# EasyEDA Pro project TeensySensorBoardV2.eprj, schematic Teensy Sensor Board V2

## Sheets
1 Teensy: Board Name: Board; Create Date: 2025-07-06; Page Name: Teensy; Project Name: TeensySensorBoardV2; Schematic Name: Teensy Sensor Board V2; Update Date: 2025-07-08; Company: Wimble Robotics; Drawed: Michael Wimble; Page Size: A4; Part Number: JLCPCB-002; Reviewed: Michael Wimble; Version: V1.0
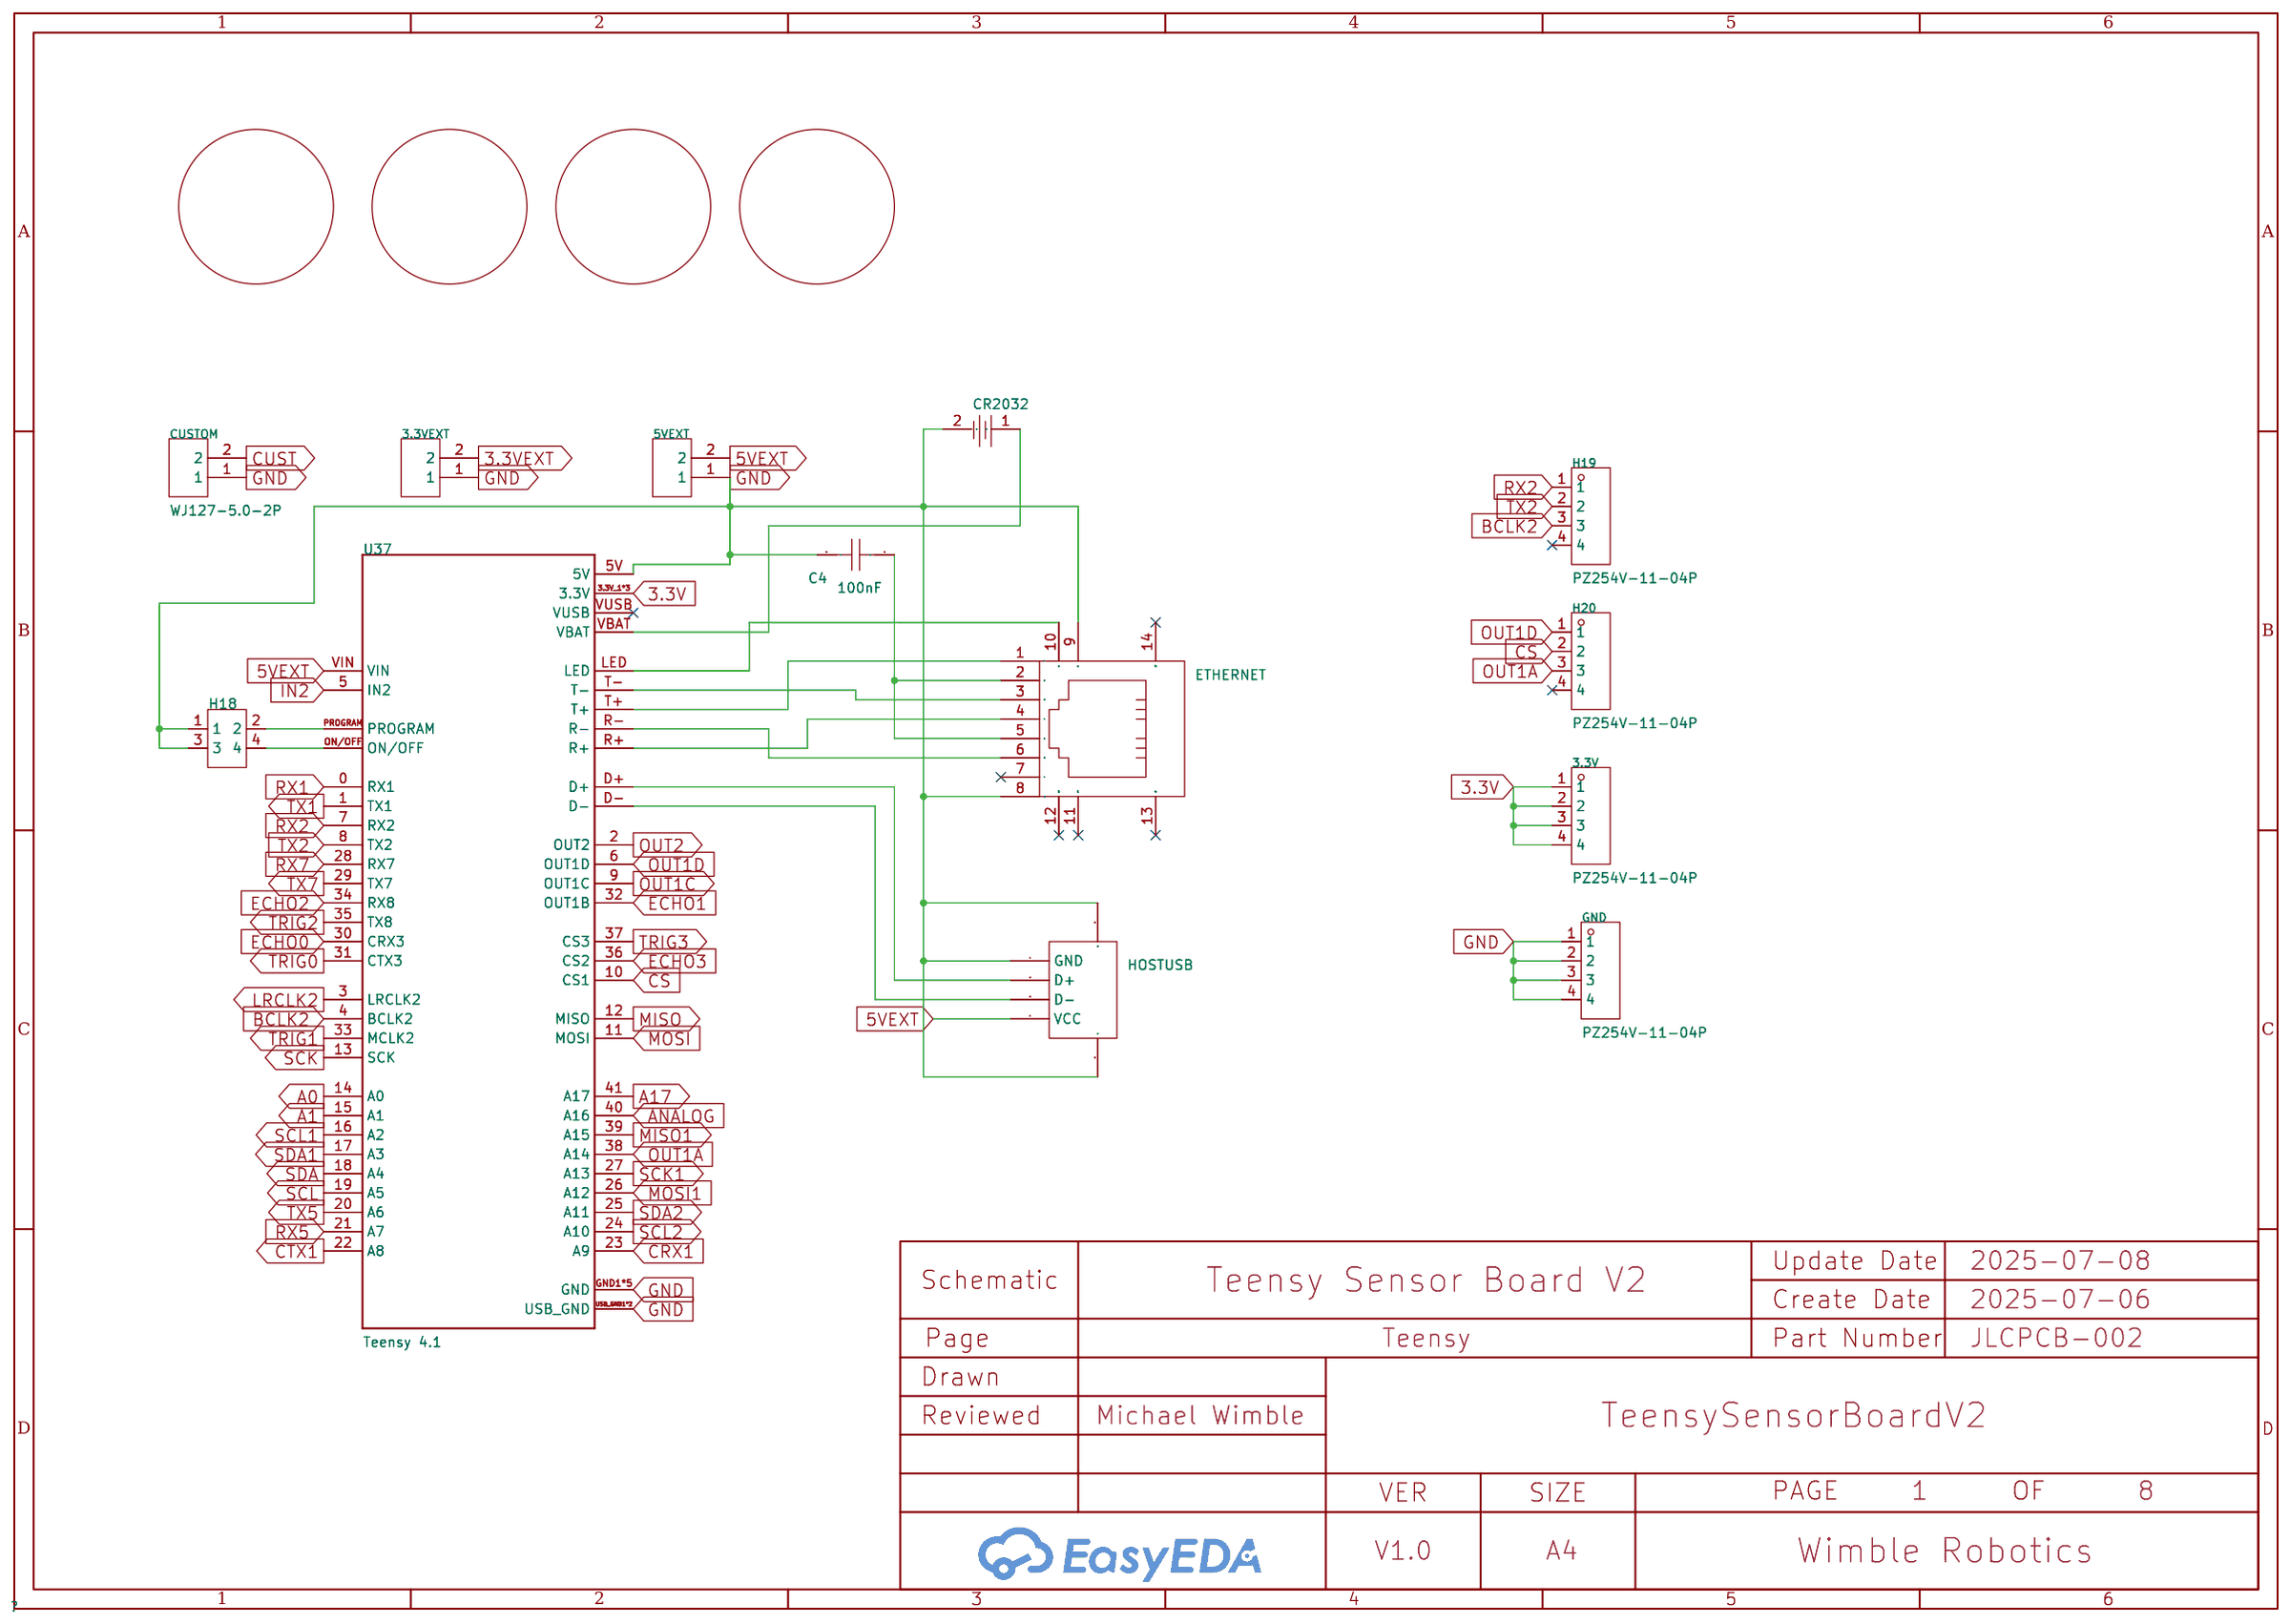
[diagram p0: Teensy]
2 I2C Multiplexer 1: Page Name: I2C Multiplexer 1; Update Date: 2025-07-07
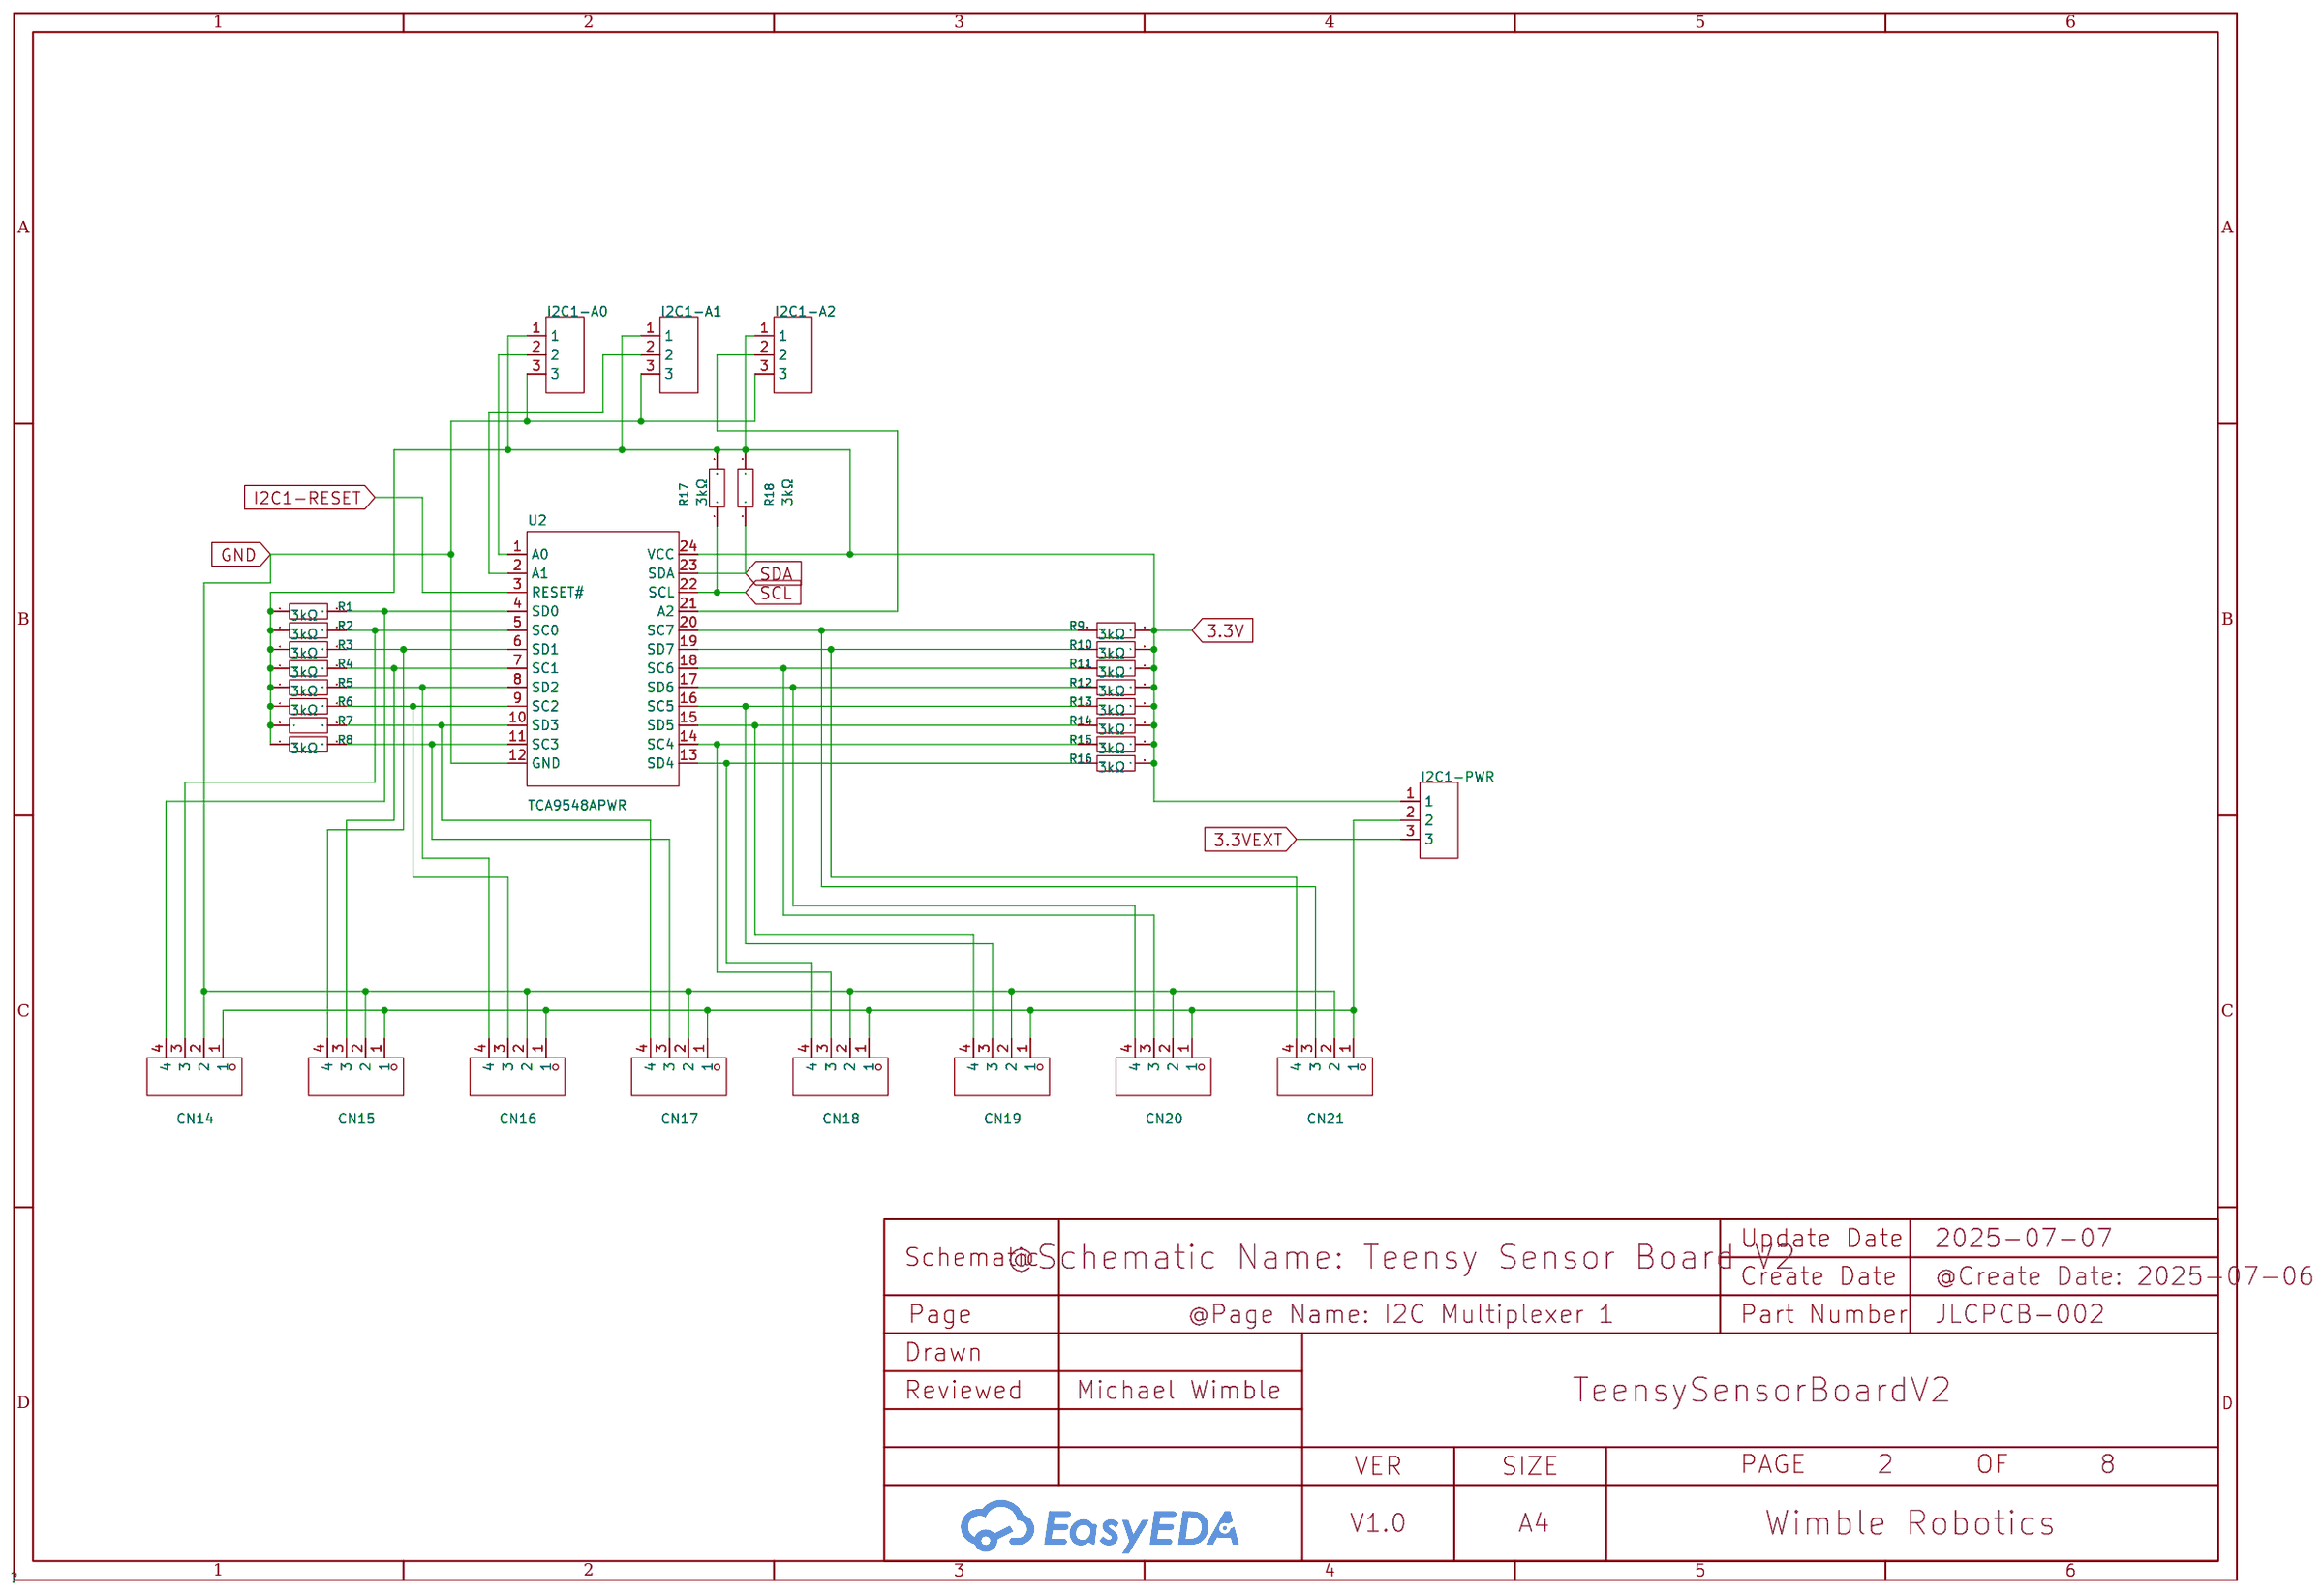
[diagram p1: I2C Multiplexer 1]
3 Misc: Page Name: Misc; Update Date: 2025-07-07
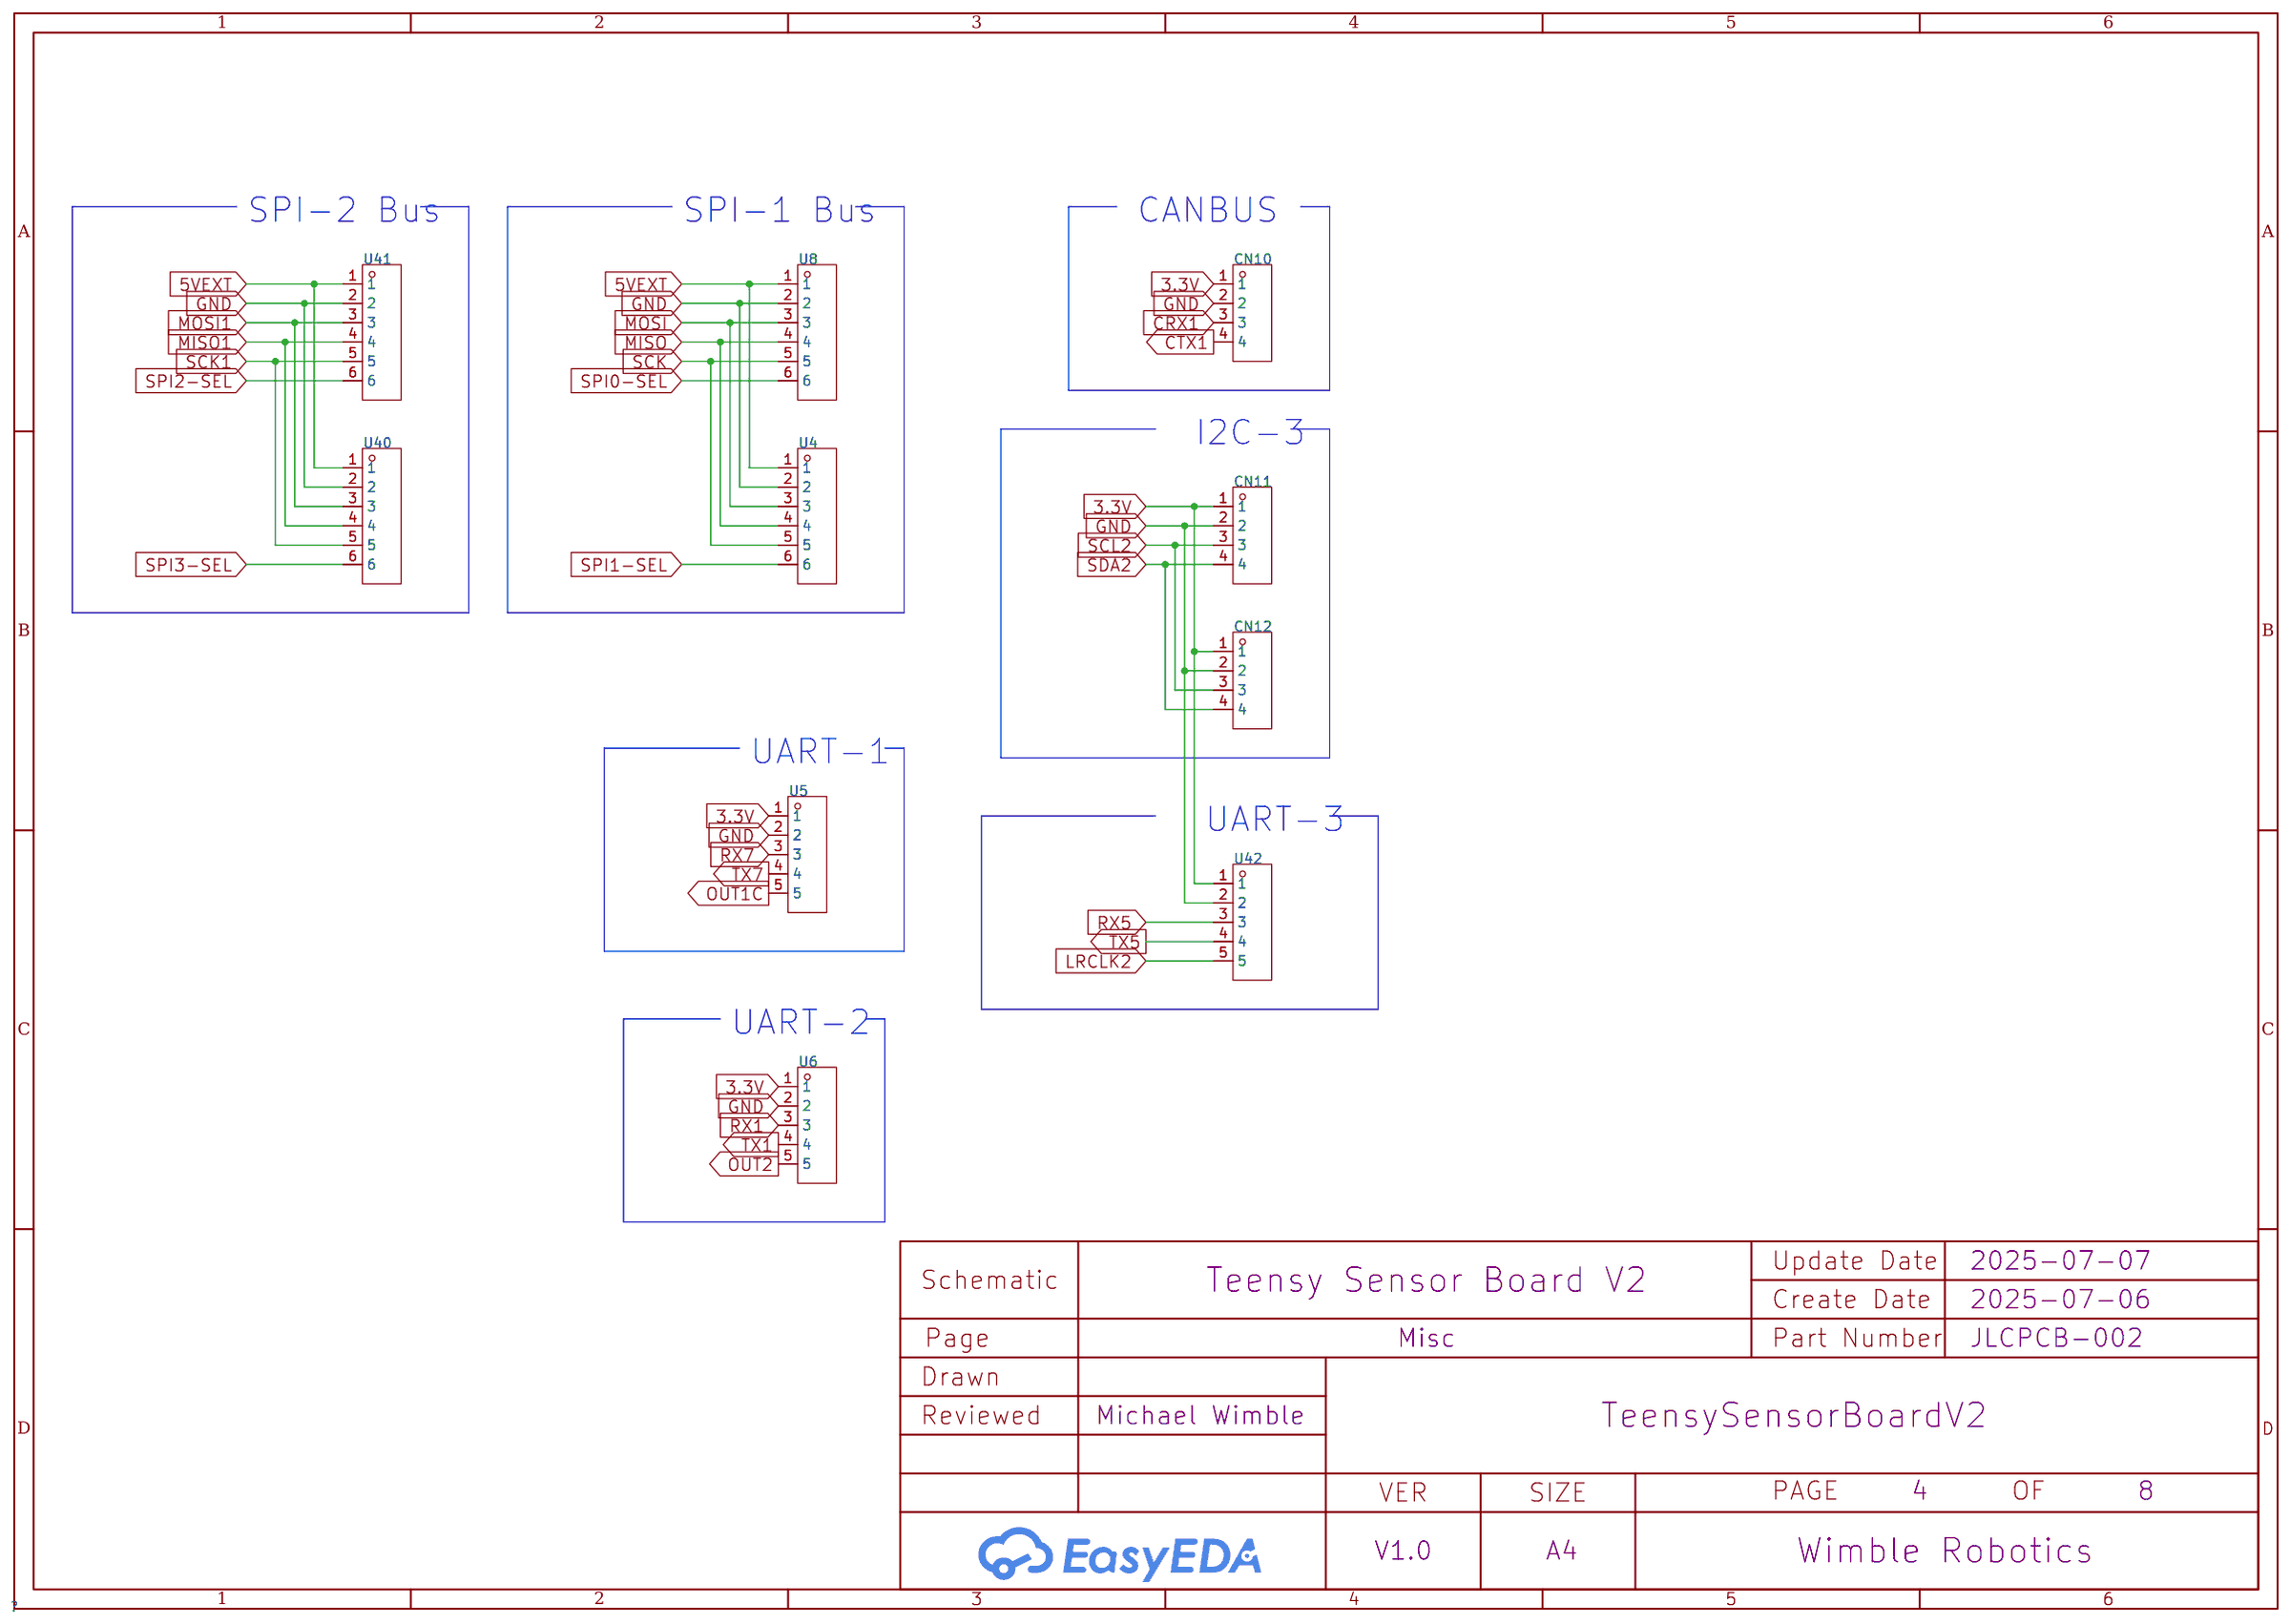
[diagram p2: Misc]
4 SONAR: Page Name: SONAR; Update Date: 2025-07-06
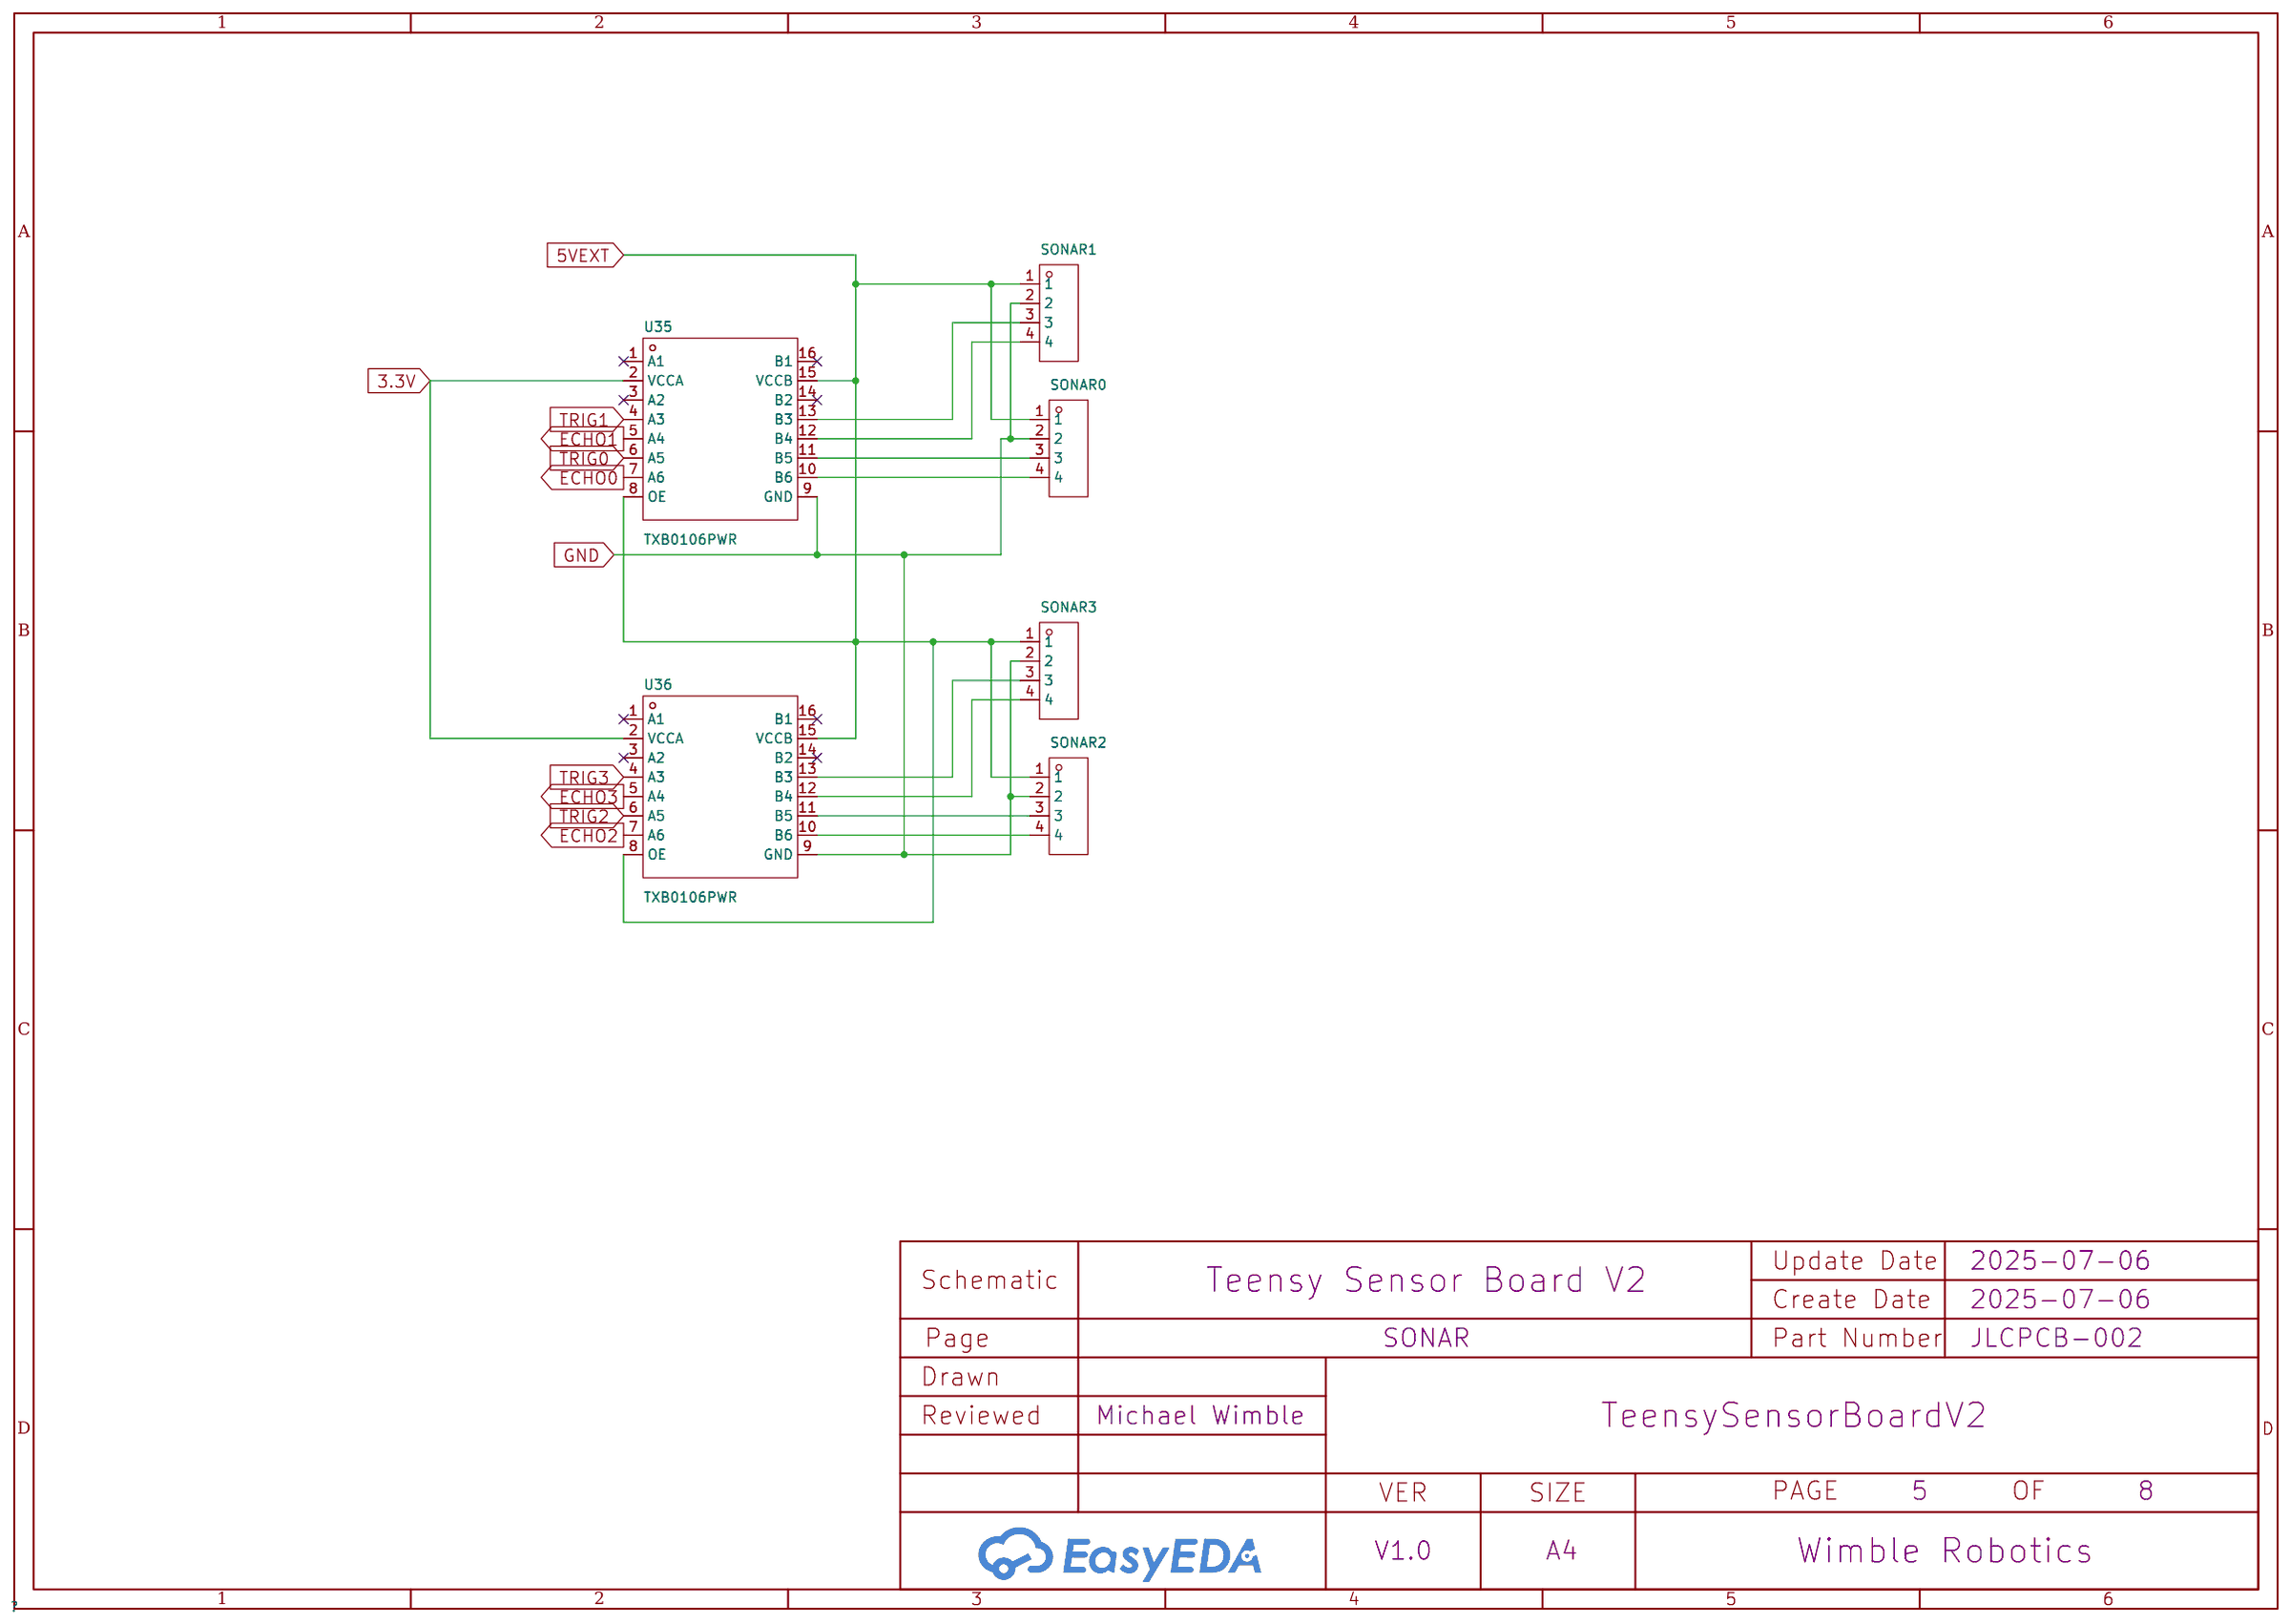
[diagram p3: SONAR]
5 I2C Multiplexer 2: Page Name: I2C Multiplexer 2; Update Date: 2025-07-07
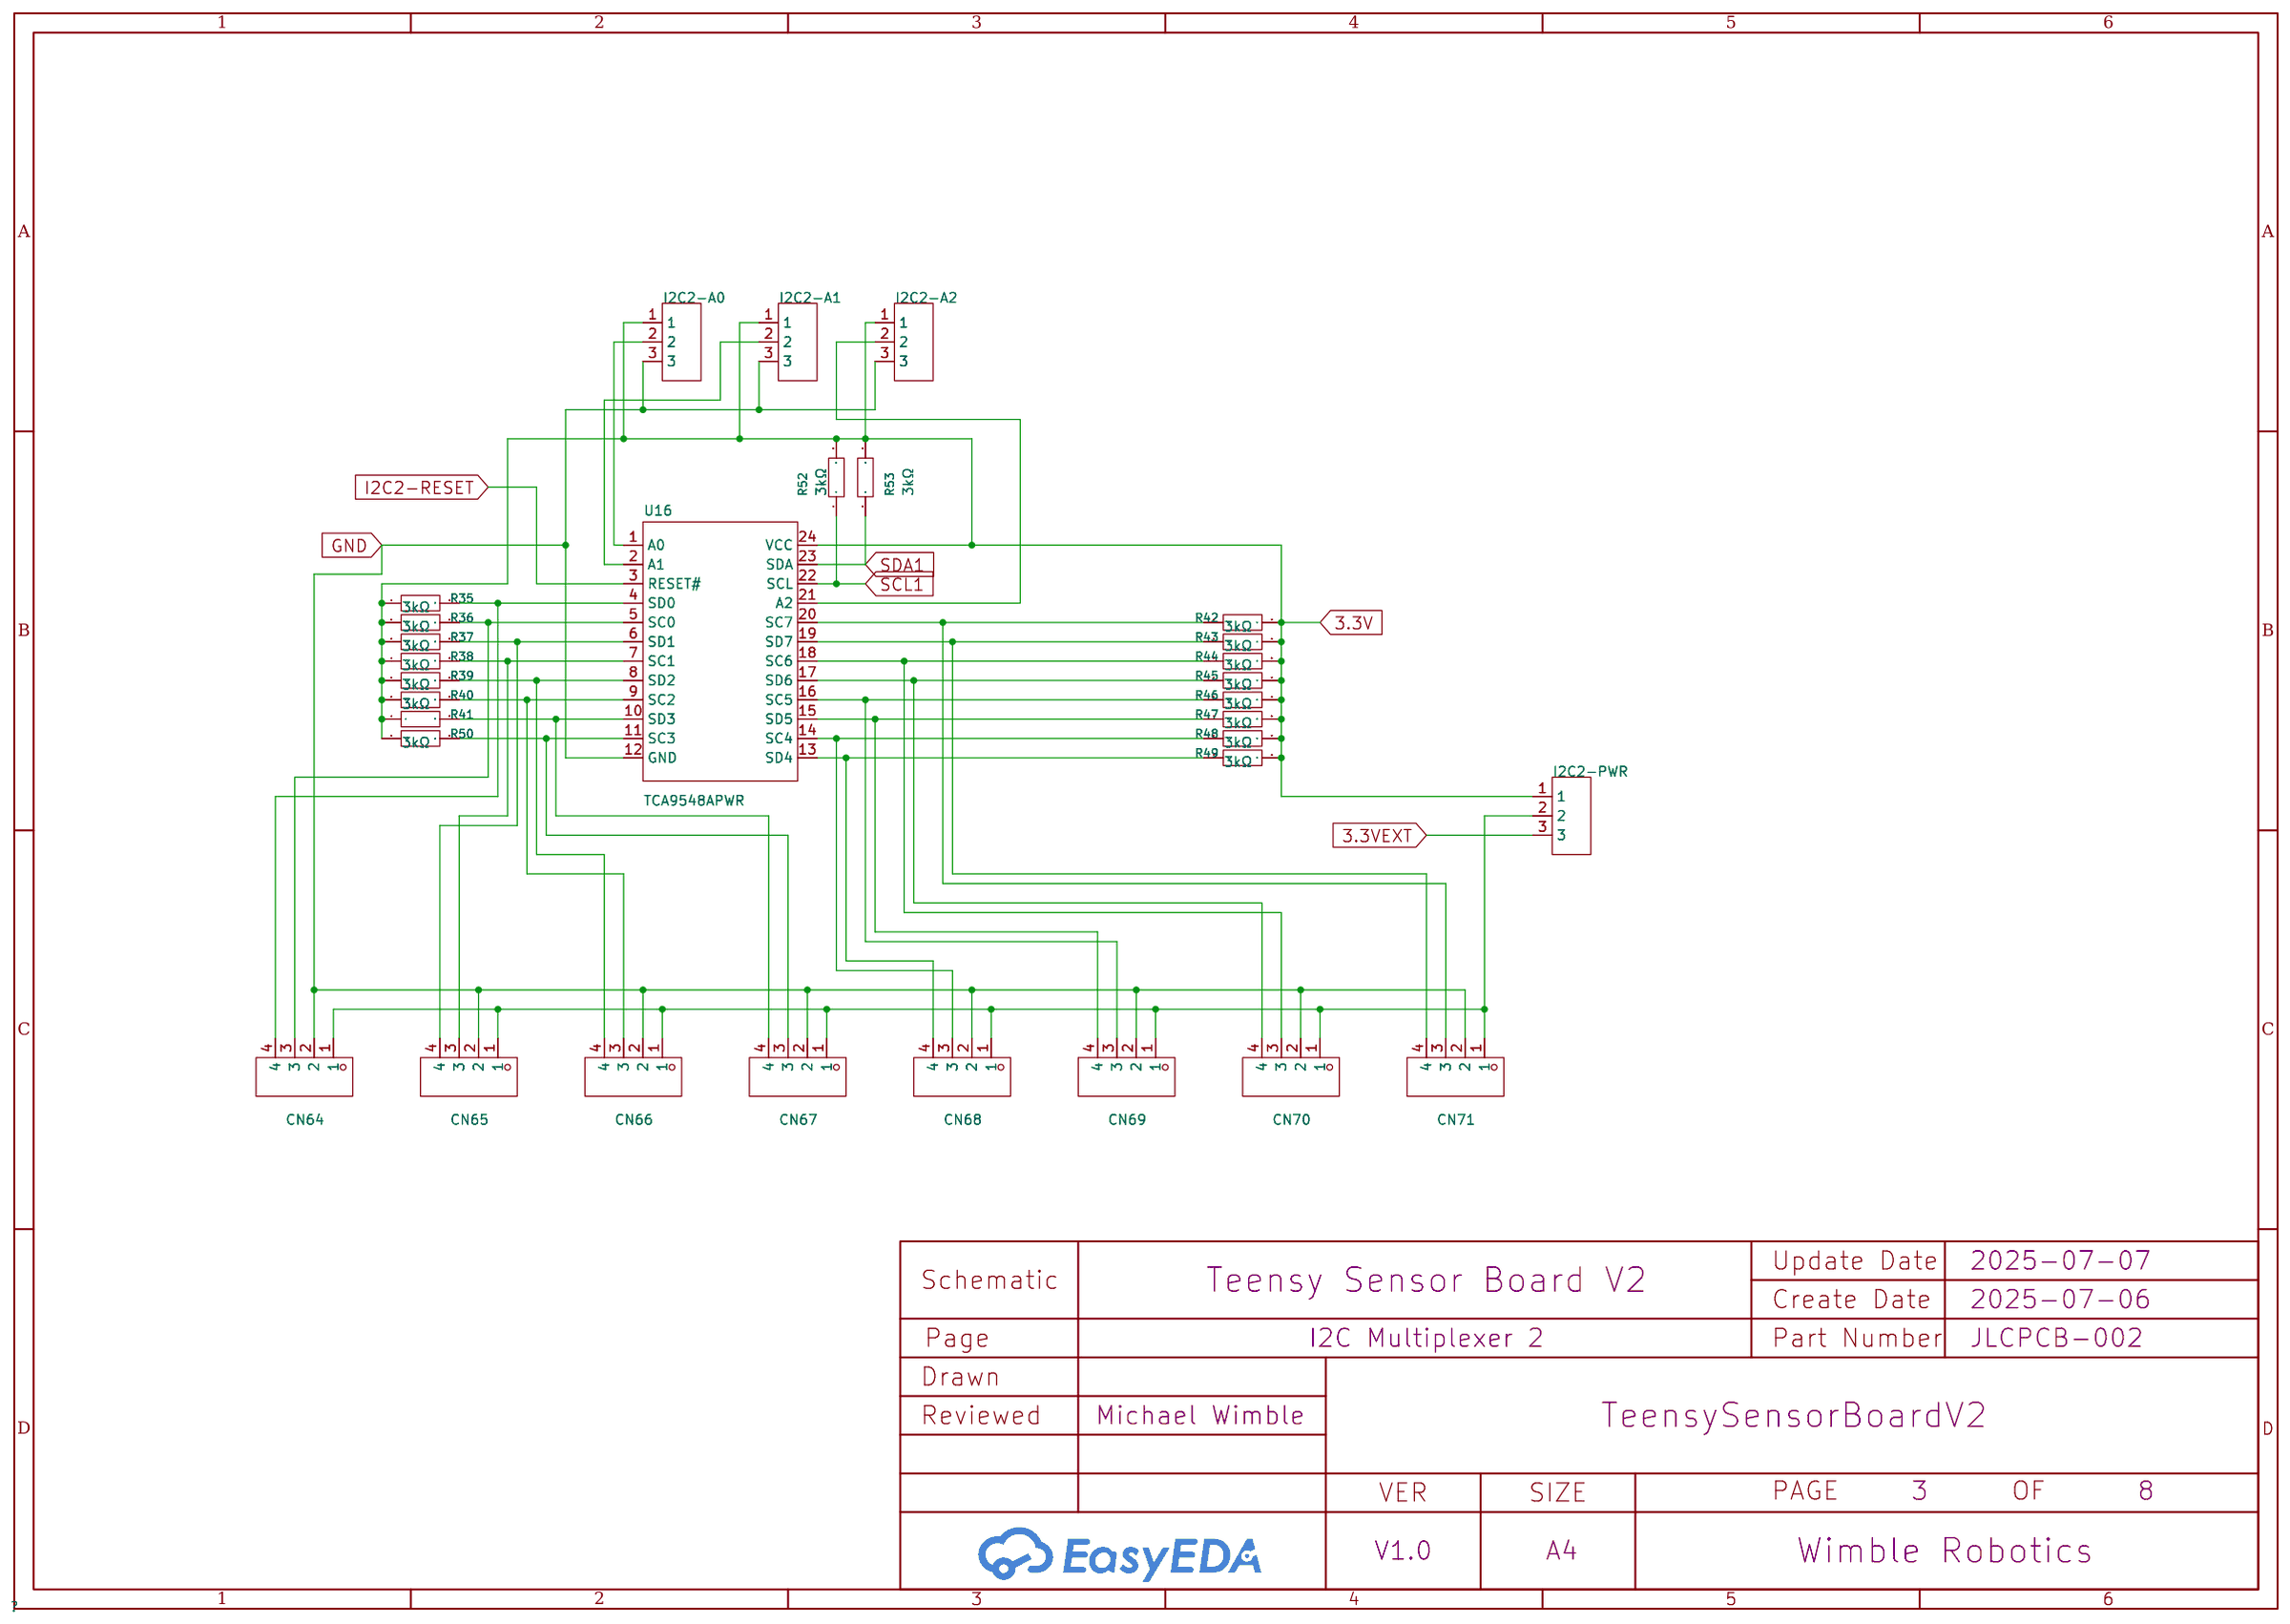
[diagram p4: I2C Multiplexer 2]
6 I2C Port Expander: Page Name: I2C Port Expander; Update Date: 2025-07-07
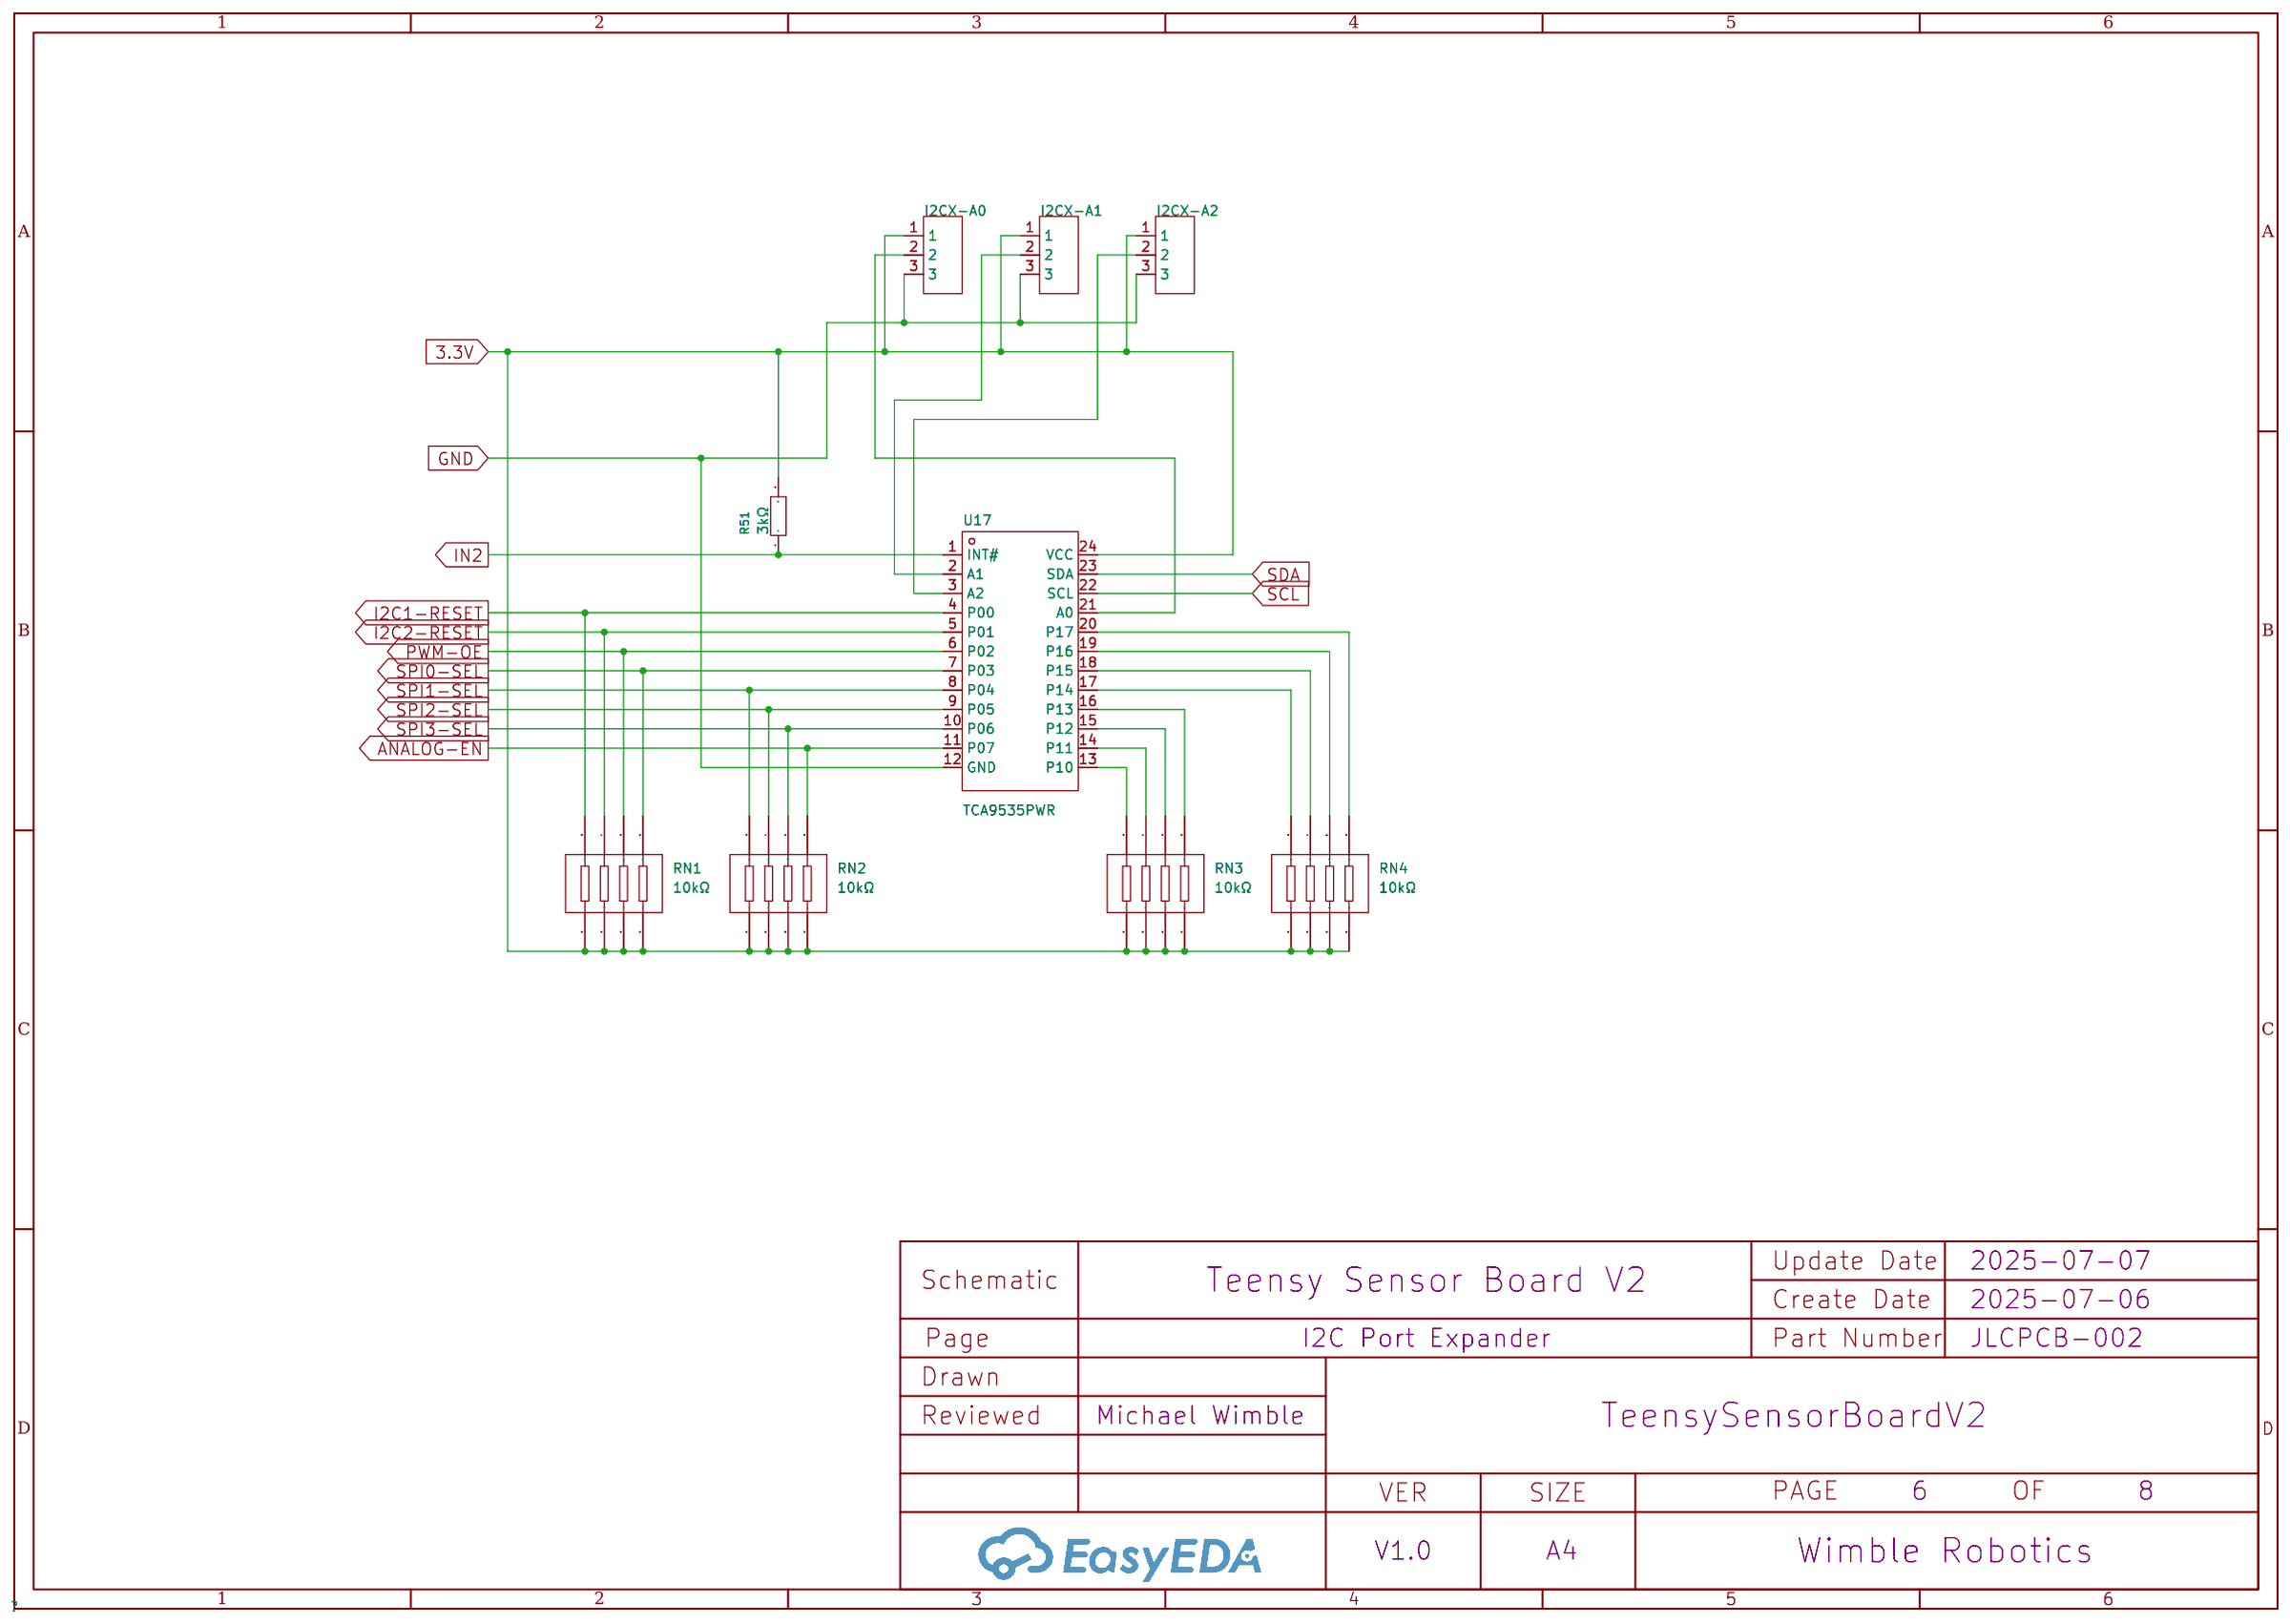
[diagram p5: I2C Port Expander]
7 PWM: Page Name: PWM; Update Date: 2025-07-06
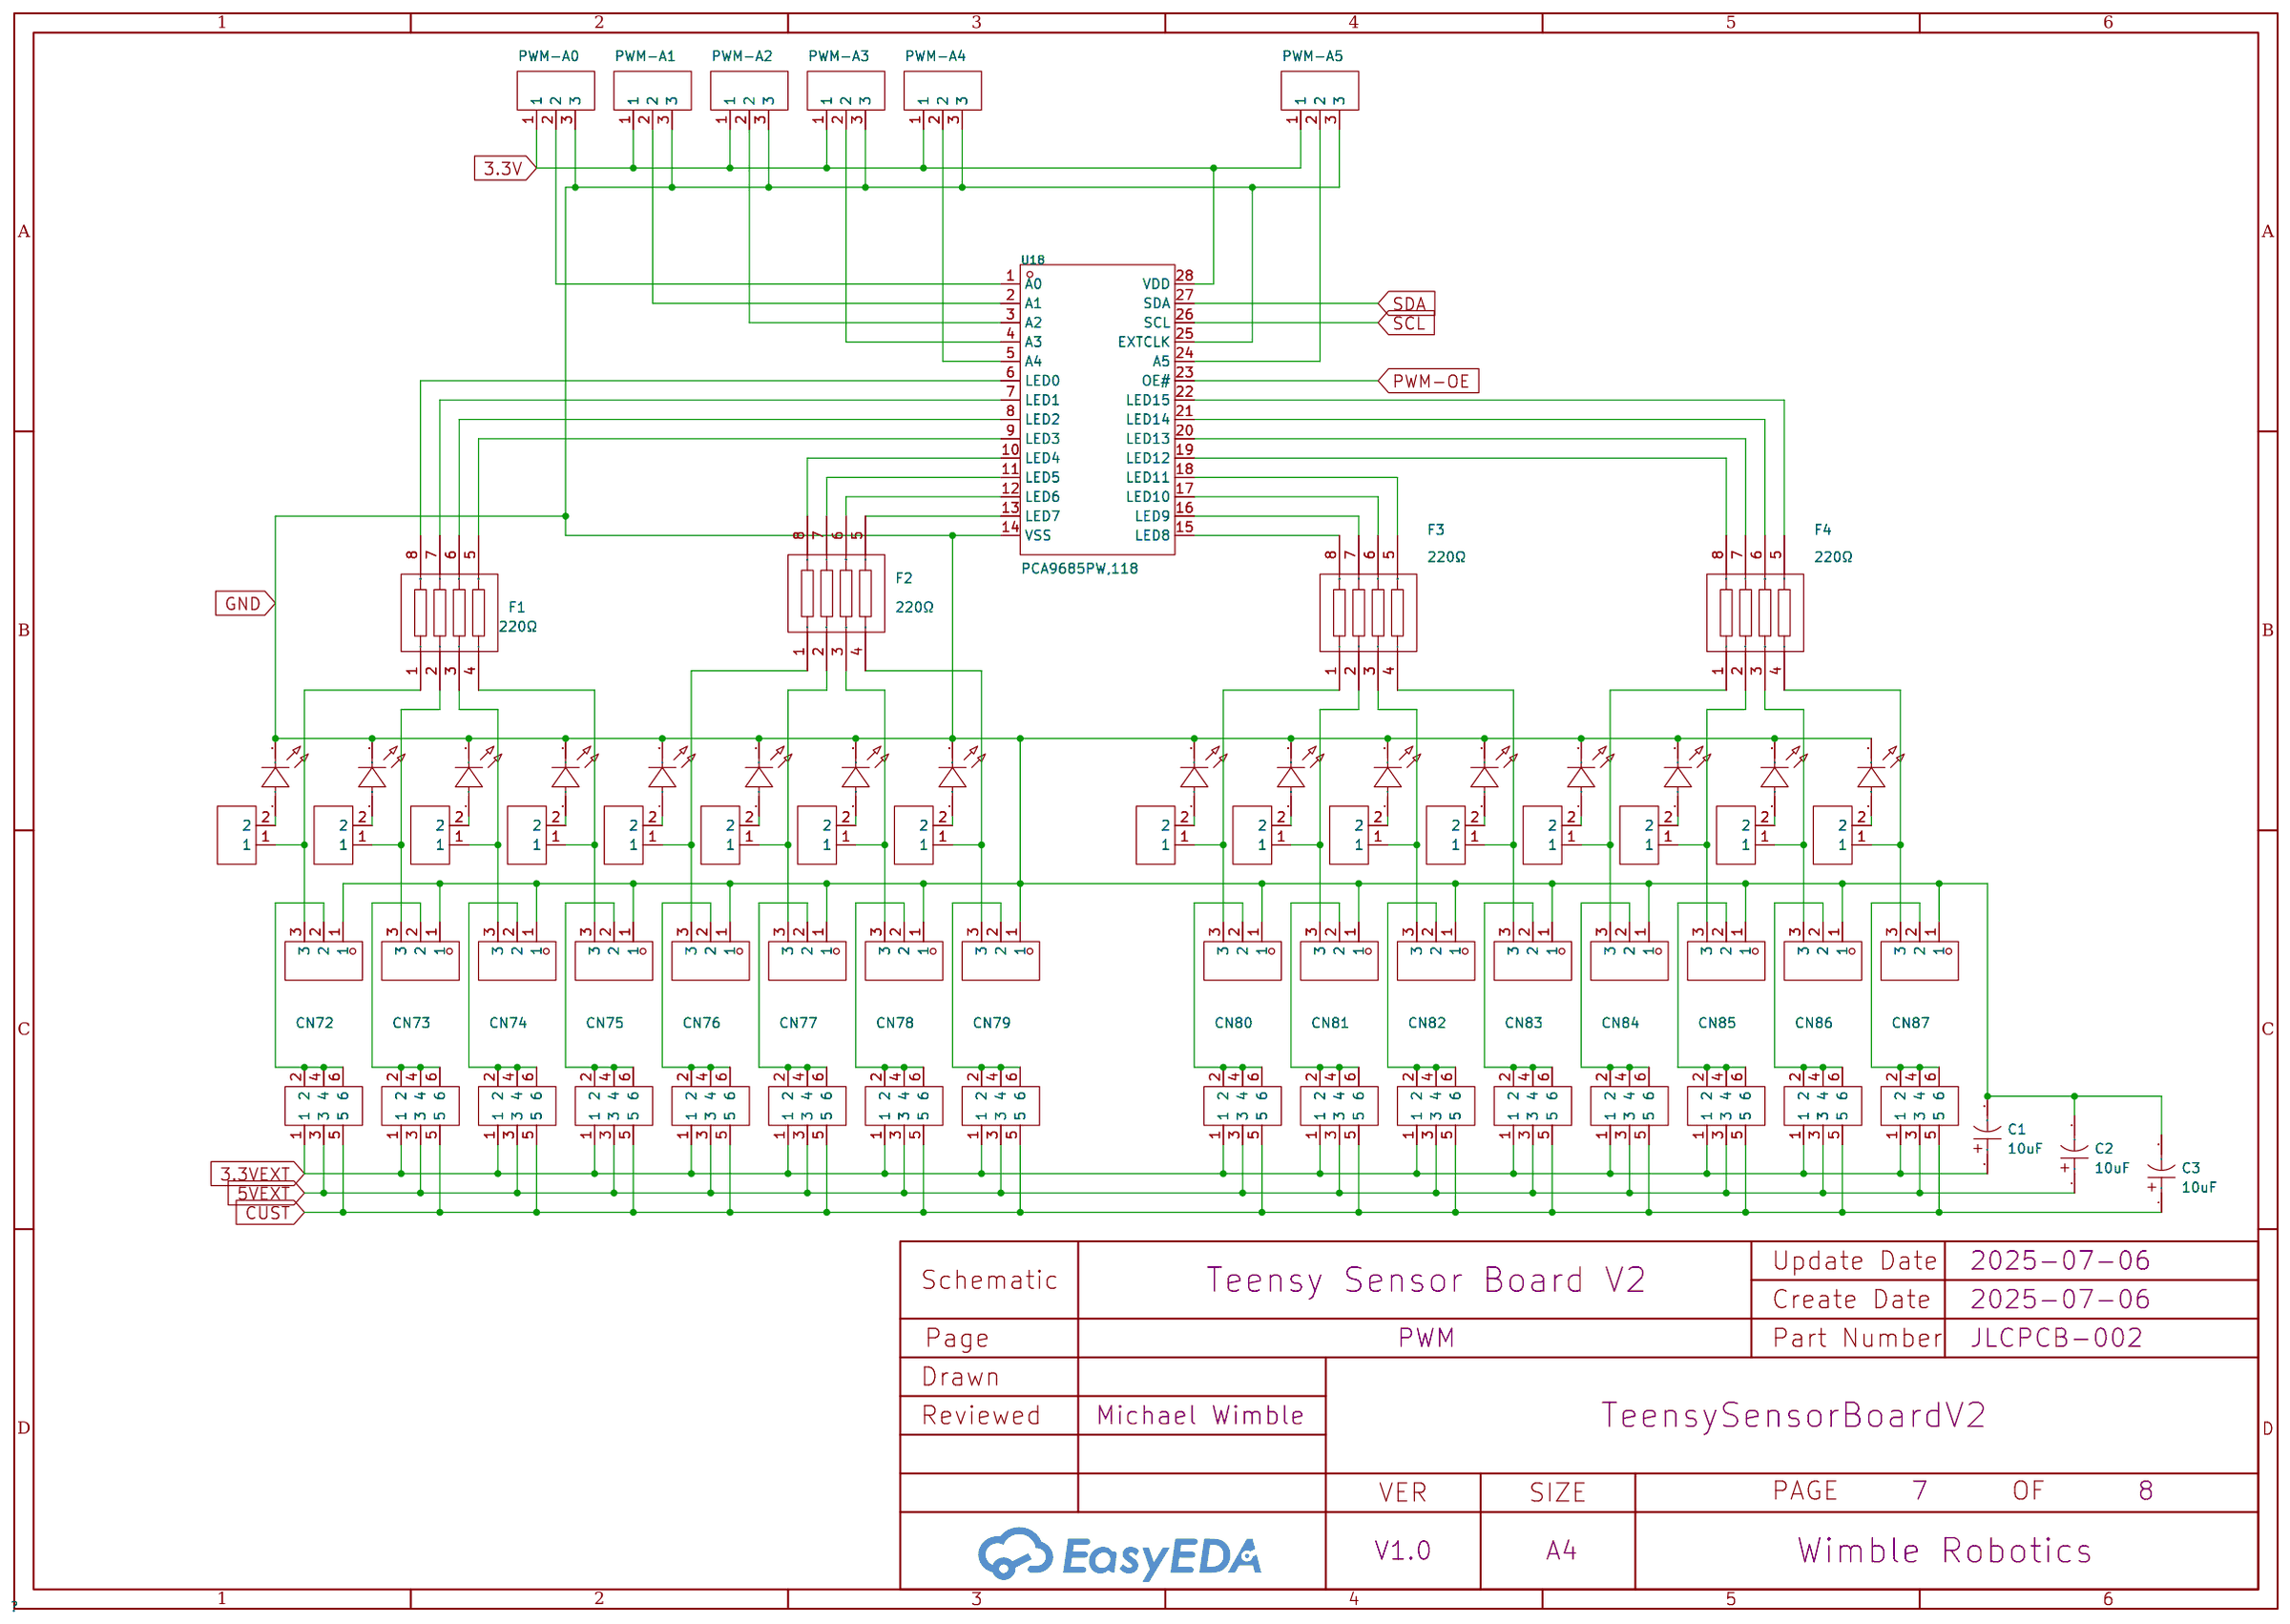
[diagram p6: PWM]
8 Analog Multiplexer: Create Date: 2025-07-07; Page Name: Analog Multiplexer; Update Date: 2025-07-07
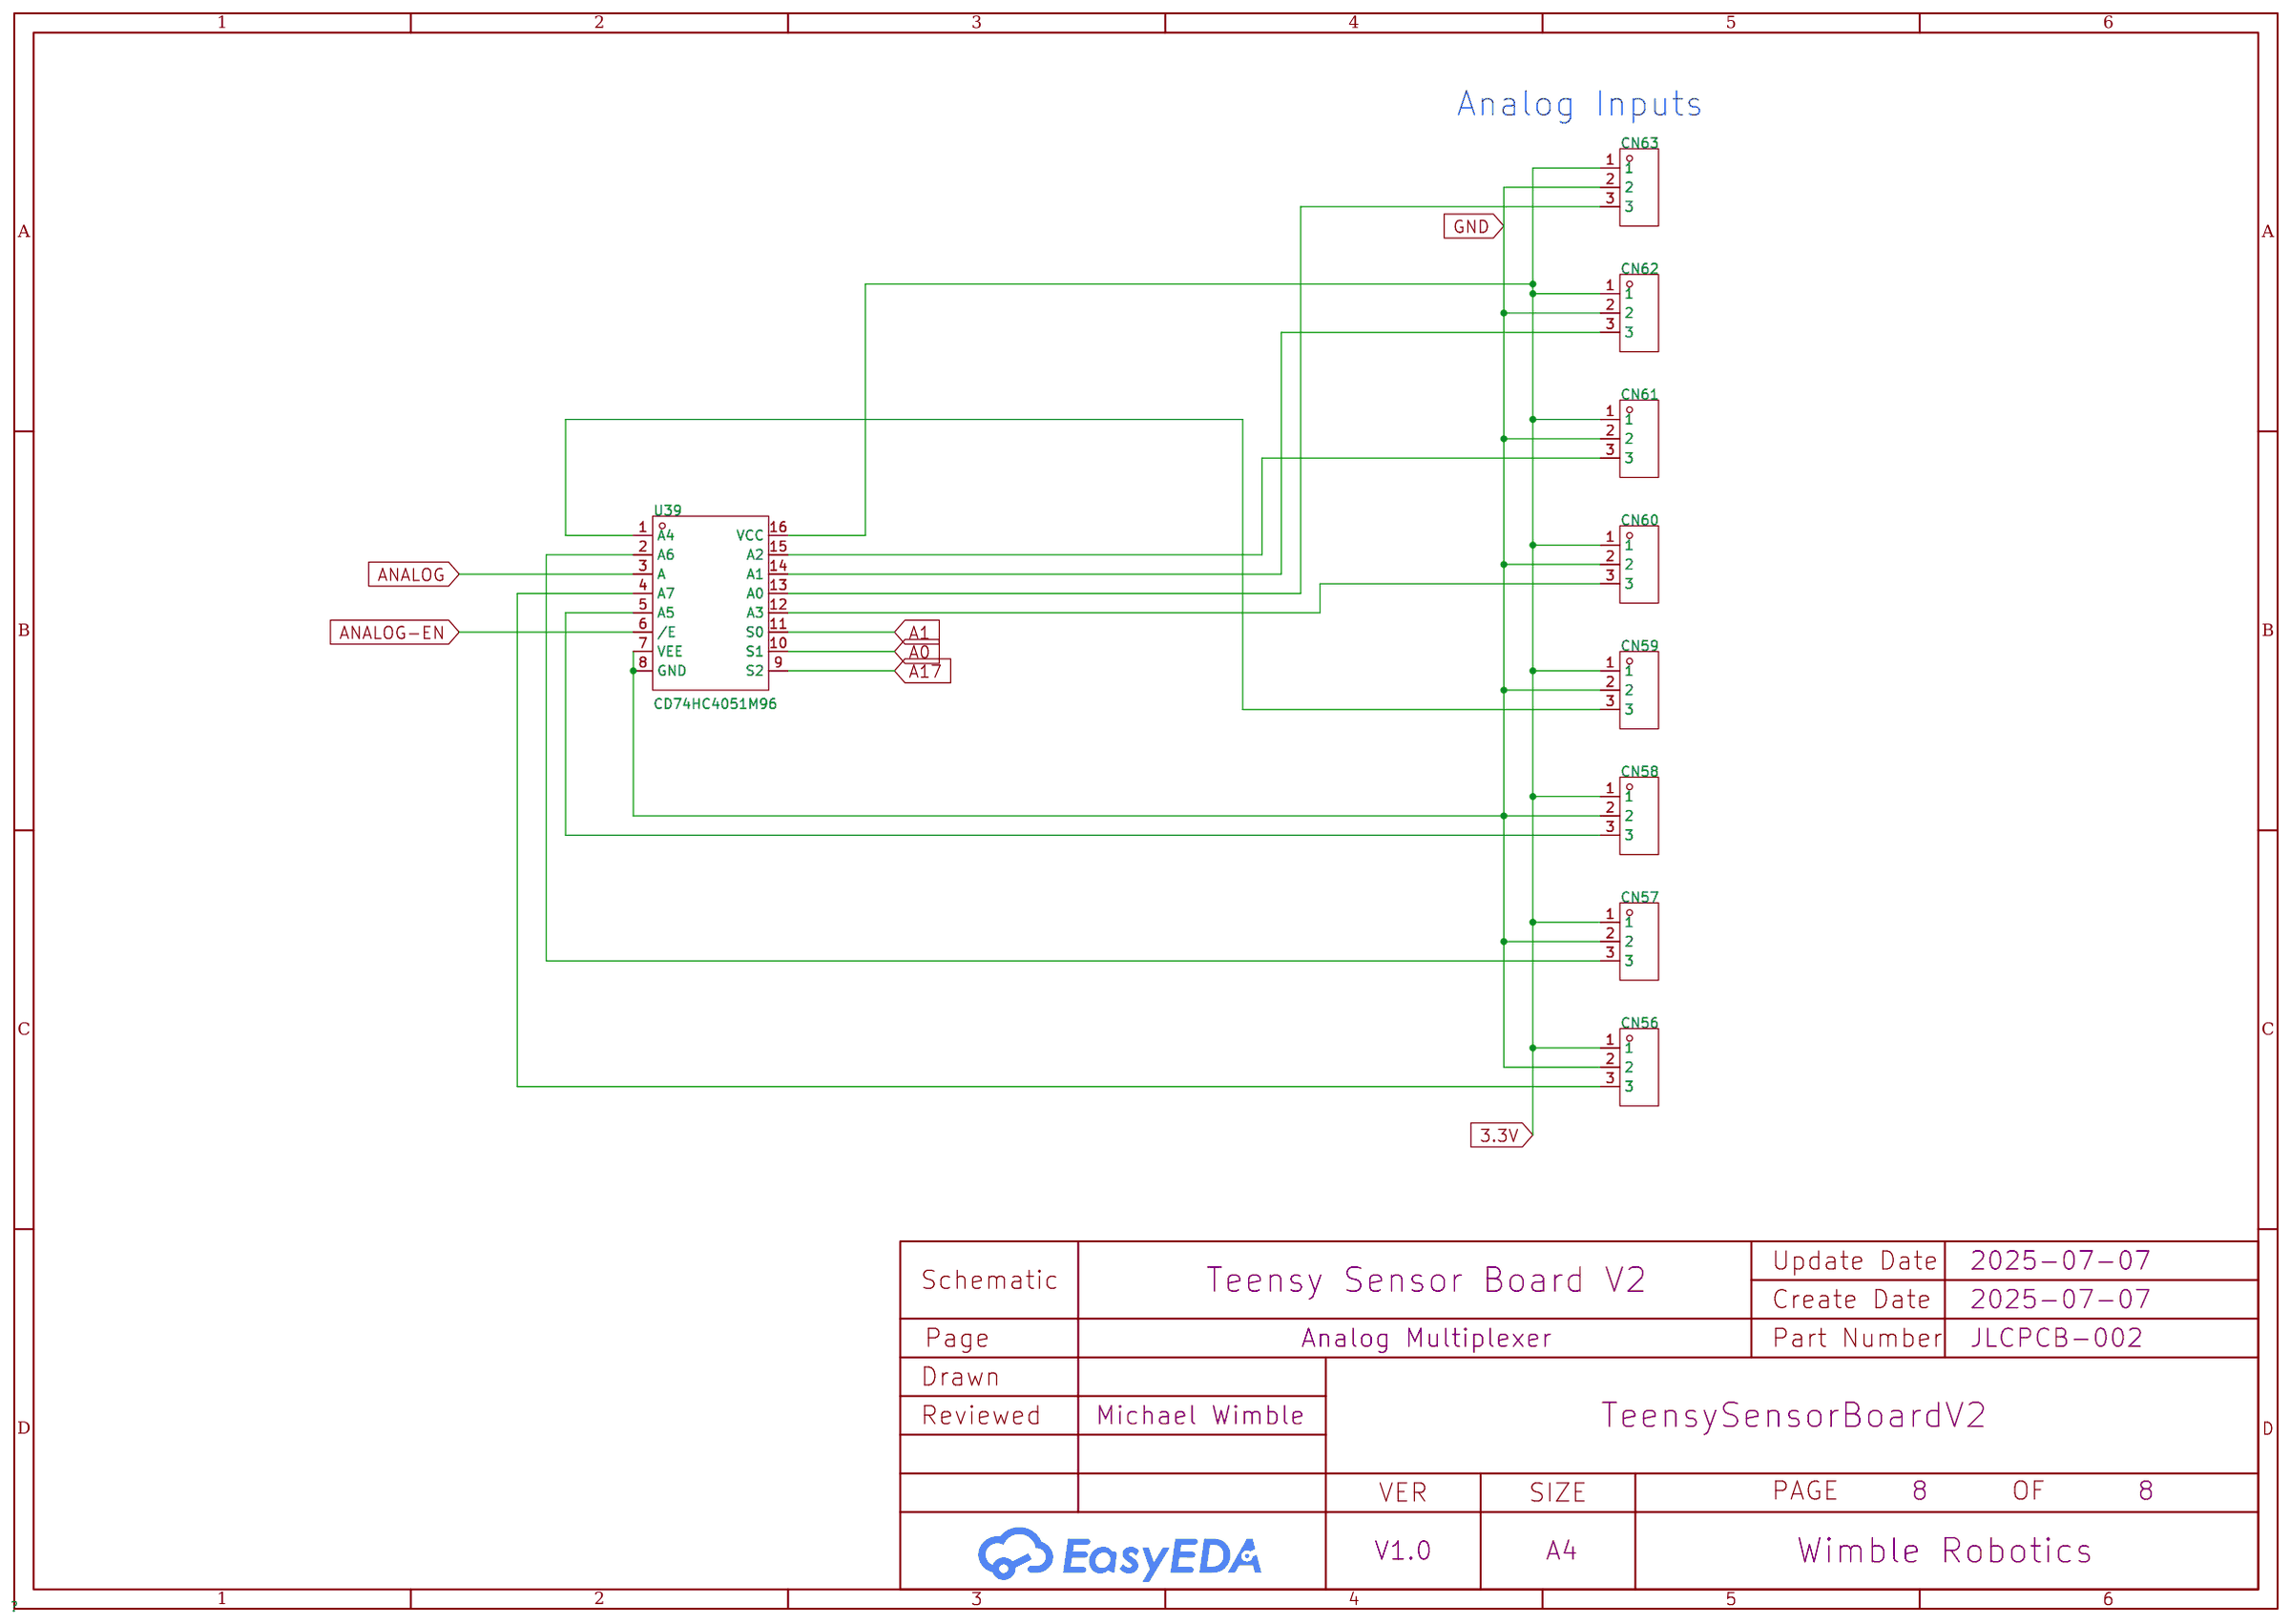
[diagram p7: Analog Multiplexer]

## Parts
sheet Analog Multiplexer
CN56  ZX-XH2.54-3PZZ  [CONN-TH_3P-P2.54_2501S-3P]
CN57  ZX-XH2.54-3PZZ  [CONN-TH_3P-P2.54_2501S-3P]
CN58  ZX-XH2.54-3PZZ  [CONN-TH_3P-P2.54_2501S-3P]
CN59  ZX-XH2.54-3PZZ  [CONN-TH_3P-P2.54_2501S-3P]
CN60  ZX-XH2.54-3PZZ  [CONN-TH_3P-P2.54_2501S-3P]
CN61  ZX-XH2.54-3PZZ  [CONN-TH_3P-P2.54_2501S-3P]
CN62  ZX-XH2.54-3PZZ  [CONN-TH_3P-P2.54_2501S-3P]
CN63  ZX-XH2.54-3PZZ  [CONN-TH_3P-P2.54_2501S-3P]
U39  CD74HC4051M96  [SOIC-16_L9.9-W3.9-P1.27-LS6.0-BL]
sheet I2C Multiplexer 1
CN14  ZX-XH2.54-4PZZ  [CONN-TH_4P-P2.50_4PIN]
CN15  ZX-XH2.54-4PZZ  [CONN-TH_4P-P2.50_4PIN]
CN16  ZX-XH2.54-4PZZ  [CONN-TH_4P-P2.50_4PIN]
CN17  ZX-XH2.54-4PZZ  [CONN-TH_4P-P2.50_4PIN]
CN18  ZX-XH2.54-4PZZ  [CONN-TH_4P-P2.50_4PIN]
CN19  ZX-XH2.54-4PZZ  [CONN-TH_4P-P2.50_4PIN]
CN20  ZX-XH2.54-4PZZ  [CONN-TH_4P-P2.50_4PIN]
CN21  ZX-XH2.54-4PZZ  [CONN-TH_4P-P2.50_4PIN]
I2C1-A0  PZ254V-11-03P  [HDR-TH_3P-P2.54-V-M]
I2C1-A1  PZ254V-11-03P  [HDR-TH_3P-P2.54-V-M]
I2C1-A2  PZ254V-11-03P  [HDR-TH_3P-P2.54-V-M]
I2C1-PWR  PZ254V-11-03P  [HDR-TH_3P-P2.54-V-M]
R1  3kΩ  [R0603]
R2  3kΩ  [R0603]
R3  3kΩ  [R0603]
R4  3kΩ  [R0603]
R5  3kΩ  [R0603]
R6  3kΩ  [R0603]
R7  3kΩ  [R0603]
R8  3kΩ  [R0603]
R9  3kΩ  [R0603]
R10  3kΩ  [R0603]
R11  3kΩ  [R0603]
R12  3kΩ  [R0603]
R13  3kΩ  [R0603]
R14  3kΩ  [R0603]
R15  3kΩ  [R0603]
R16  3kΩ  [R0603]
R17  3kΩ  [R0603]
R18  3kΩ  [R0603]
U2  TCA9548APWR  [TSSOP-24_L7.8-W4.4-P0.65-LS6.4-BL]
sheet I2C Multiplexer 2
CN64  ZX-XH2.54-4PZZ  [CONN-TH_4P-P2.50_4PIN]
CN65  ZX-XH2.54-4PZZ  [CONN-TH_4P-P2.50_4PIN]
CN66  ZX-XH2.54-4PZZ  [CONN-TH_4P-P2.50_4PIN]
CN67  ZX-XH2.54-4PZZ  [CONN-TH_4P-P2.50_4PIN]
CN68  ZX-XH2.54-4PZZ  [CONN-TH_4P-P2.50_4PIN]
CN69  ZX-XH2.54-4PZZ  [CONN-TH_4P-P2.50_4PIN]
CN70  ZX-XH2.54-4PZZ  [CONN-TH_4P-P2.50_4PIN]
CN71  ZX-XH2.54-4PZZ  [CONN-TH_4P-P2.50_4PIN]
I2C2-A0  PZ254V-11-03P  [HDR-TH_3P-P2.54-V-M]
I2C2-A1  PZ254V-11-03P  [HDR-TH_3P-P2.54-V-M]
I2C2-A2  PZ254V-11-03P  [HDR-TH_3P-P2.54-V-M]
I2C2-PWR  PZ254V-11-03P  [HDR-TH_3P-P2.54-V-M]
R35  3kΩ  [R0603]
R36  3kΩ  [R0603]
R37  3kΩ  [R0603]
R38  3kΩ  [R0603]
R39  3kΩ  [R0603]
R40  3kΩ  [R0603]
R41  3kΩ  [R0603]
R42  3kΩ  [R0603]
R43  3kΩ  [R0603]
R44  3kΩ  [R0603]
R45  3kΩ  [R0603]
R46  3kΩ  [R0603]
R47  3kΩ  [R0603]
R48  3kΩ  [R0603]
R49  3kΩ  [R0603]
R50  3kΩ  [R0603]
R52  3kΩ  [R0603]
R53  3kΩ  [R0603]
U16  TCA9548APWR  [TSSOP-24_L7.8-W4.4-P0.65-LS6.4-BL]
sheet I2C Port Expander
I2CX-A0  PZ254V-11-03P  [HDR-TH_3P-P2.54-V-M]
I2CX-A1  PZ254V-11-03P  [HDR-TH_3P-P2.54-V-M]
I2CX-A2  PZ254V-11-03P  [HDR-TH_3P-P2.54-V-M]
R51  3kΩ  [R0603]
RN1  10kΩ  [RES-ARRAY-SMD_0603-8P-L3.2-W1.6-BL]
RN2  10kΩ  [RES-ARRAY-SMD_0603-8P-L3.2-W1.6-BL]
RN3  10kΩ  [RES-ARRAY-SMD_0603-8P-L3.2-W1.6-BL]
RN4  10kΩ  [RES-ARRAY-SMD_0603-8P-L3.2-W1.6-BL]
U17  TCA9535PWR  [TSSOP-24_L7.8-W4.4-P0.65-LS6.4-BL]
sheet Misc
CN10  ZX-XH2.54-4PZZ  [CONN-TH_4P-P2.50_4PIN]
CN11  ZX-XH2.54-4PZZ  [CONN-TH_4P-P2.50_4PIN]
CN12  ZX-XH2.54-4PZZ  [CONN-TH_4P-P2.50_4PIN]
U4  ZX-XH2.54-6PZZ  [CONN-TH_6P-P2.50_ZX-XH2.54-6PZZ]
U5  ZX-XH2.54-5PZZ  [CONN-TH_5P-P2.50_ZX-XH2.54-5PZZ]
U6  ZX-XH2.54-5PZZ  [CONN-TH_5P-P2.50_ZX-XH2.54-5PZZ]
U8  ZX-XH2.54-6PZZ  [CONN-TH_6P-P2.50_ZX-XH2.54-6PZZ]
U40  ZX-XH2.54-6PZZ  [CONN-TH_6P-P2.50_ZX-XH2.54-6PZZ]
U41  ZX-XH2.54-6PZZ  [CONN-TH_6P-P2.50_ZX-XH2.54-6PZZ]
U42  ZX-XH2.54-5PZZ  [CONN-TH_5P-P2.50_ZX-XH2.54-5PZZ]
sheet PWM
C1  10uF  [CAP-SMD_BD4.0-L4.3-W4.3-LS5.0-FD]
C2  10uF  [CAP-SMD_BD4.0-L4.3-W4.3-LS5.0-FD]
C3  10uF  [CAP-SMD_BD4.0-L4.3-W4.3-LS5.0-FD]
CN72  ZX-XH2.54-3PZZ  [CONN-TH_3P-P2.54_2501S-3P]
CN73  ZX-XH2.54-3PZZ  [CONN-TH_3P-P2.54_2501S-3P]
CN74  ZX-XH2.54-3PZZ  [CONN-TH_3P-P2.54_2501S-3P]
CN75  ZX-XH2.54-3PZZ  [CONN-TH_3P-P2.54_2501S-3P]
CN76  ZX-XH2.54-3PZZ  [CONN-TH_3P-P2.54_2501S-3P]
CN77  ZX-XH2.54-3PZZ  [CONN-TH_3P-P2.54_2501S-3P]
CN78  ZX-XH2.54-3PZZ  [CONN-TH_3P-P2.54_2501S-3P]
CN79  ZX-XH2.54-3PZZ  [CONN-TH_3P-P2.54_2501S-3P]
CN80  ZX-XH2.54-3PZZ  [CONN-TH_3P-P2.54_2501S-3P]
CN81  ZX-XH2.54-3PZZ  [CONN-TH_3P-P2.54_2501S-3P]
CN82  ZX-XH2.54-3PZZ  [CONN-TH_3P-P2.54_2501S-3P]
CN83  ZX-XH2.54-3PZZ  [CONN-TH_3P-P2.54_2501S-3P]
CN84  ZX-XH2.54-3PZZ  [CONN-TH_3P-P2.54_2501S-3P]
CN85  ZX-XH2.54-3PZZ  [CONN-TH_3P-P2.54_2501S-3P]
CN86  ZX-XH2.54-3PZZ  [CONN-TH_3P-P2.54_2501S-3P]
CN87  ZX-XH2.54-3PZZ  [CONN-TH_3P-P2.54_2501S-3P]
F1  220Ω  [RES-ARRAY-SMD_0603-8P-L3.2-W1.6-TL]
F2  220Ω  [RES-ARRAY-SMD_0603-8P-L3.2-W1.6-TL]
F3  220Ω  [RES-ARRAY-SMD_0603-8P-L3.2-W1.6-TL]
F4  220Ω  [RES-ARRAY-SMD_0603-8P-L3.2-W1.6-TL]
H2  PH-00013  [HDR-TH_2P-P2.54-V-M-R2-C1-S2.54]
H3  PH-00013  [HDR-TH_2P-P2.54-V-M-R2-C1-S2.54]
H4  PH-00013  [HDR-TH_2P-P2.54-V-M-R2-C1-S2.54]
H5  PH-00013  [HDR-TH_2P-P2.54-V-M-R2-C1-S2.54]
H6  PH-00013  [HDR-TH_2P-P2.54-V-M-R2-C1-S2.54]
H7  PH-00013  [HDR-TH_2P-P2.54-V-M-R2-C1-S2.54]
H8  PH-00013  [HDR-TH_2P-P2.54-V-M-R2-C1-S2.54]
H9  PH-00013  [HDR-TH_2P-P2.54-V-M-R2-C1-S2.54]
H10  PH-00013  [HDR-TH_2P-P2.54-V-M-R2-C1-S2.54]
H11  PH-00013  [HDR-TH_2P-P2.54-V-M-R2-C1-S2.54]
H12  PH-00013  [HDR-TH_2P-P2.54-V-M-R2-C1-S2.54]
H13  PH-00013  [HDR-TH_2P-P2.54-V-M-R2-C1-S2.54]
H14  PH-00013  [HDR-TH_2P-P2.54-V-M-R2-C1-S2.54]
H15  PH-00013  [HDR-TH_2P-P2.54-V-M-R2-C1-S2.54]
H16  PH-00013  [HDR-TH_2P-P2.54-V-M-R2-C1-S2.54]
H17  PH-00013  [HDR-TH_2P-P2.54-V-M-R2-C1-S2.54]
LED1  19-219/GHC-YR2T1B5Y/3T  [LED-SMD_L1.6-W0.8_19-219-GHC-YR2T1B5Y-3T]
LED2  19-219/GHC-YR2T1B5Y/3T  [LED-SMD_L1.6-W0.8_19-219-GHC-YR2T1B5Y-3T]
LED3  19-219/GHC-YR2T1B5Y/3T  [LED-SMD_L1.6-W0.8_19-219-GHC-YR2T1B5Y-3T]
LED4  19-219/GHC-YR2T1B5Y/3T  [LED-SMD_L1.6-W0.8_19-219-GHC-YR2T1B5Y-3T]
LED5  19-219/GHC-YR2T1B5Y/3T  [LED-SMD_L1.6-W0.8_19-219-GHC-YR2T1B5Y-3T]
LED6  19-219/GHC-YR2T1B5Y/3T  [LED-SMD_L1.6-W0.8_19-219-GHC-YR2T1B5Y-3T]
LED7  19-219/GHC-YR2T1B5Y/3T  [LED-SMD_L1.6-W0.8_19-219-GHC-YR2T1B5Y-3T]
LED8  19-219/GHC-YR2T1B5Y/3T  [LED-SMD_L1.6-W0.8_19-219-GHC-YR2T1B5Y-3T]
LED9  19-219/GHC-YR2T1B5Y/3T  [LED-SMD_L1.6-W0.8_19-219-GHC-YR2T1B5Y-3T]
LED10  19-219/GHC-YR2T1B5Y/3T  [LED-SMD_L1.6-W0.8_19-219-GHC-YR2T1B5Y-3T]
LED11  19-219/GHC-YR2T1B5Y/3T  [LED-SMD_L1.6-W0.8_19-219-GHC-YR2T1B5Y-3T]
LED12  19-219/GHC-YR2T1B5Y/3T  [LED-SMD_L1.6-W0.8_19-219-GHC-YR2T1B5Y-3T]
LED13  19-219/GHC-YR2T1B5Y/3T  [LED-SMD_L1.6-W0.8_19-219-GHC-YR2T1B5Y-3T]
LED14  19-219/GHC-YR2T1B5Y/3T  [LED-SMD_L1.6-W0.8_19-219-GHC-YR2T1B5Y-3T]
LED15  19-219/GHC-YR2T1B5Y/3T  [LED-SMD_L1.6-W0.8_19-219-GHC-YR2T1B5Y-3T]
LED16  19-219/GHC-YR2T1B5Y/3T  [LED-SMD_L1.6-W0.8_19-219-GHC-YR2T1B5Y-3T]
PWM-A0  PZ254V-11-03P  [HDR-TH_3P-P2.54-V-M]
PWM-A1  PZ254V-11-03P  [HDR-TH_3P-P2.54-V-M]
PWM-A2  PZ254V-11-03P  [HDR-TH_3P-P2.54-V-M]
PWM-A3  PZ254V-11-03P  [HDR-TH_3P-P2.54-V-M]
PWM-A4  PZ254V-11-03P  [HDR-TH_3P-P2.54-V-M]
PWM-A5  PZ254V-11-03P  [HDR-TH_3P-P2.54-V-M]
U18  PCA9685PW,118  [TSSOP-28_L9.7-W4.4-P0.65-LS6.4-TL]
U19  BX-PZ2.54-2-3PZZ  [HDR-TH_6P-P2.54-V-M-R2-C3-S2.54]
U20  BX-PZ2.54-2-3PZZ  [HDR-TH_6P-P2.54-V-M-R2-C3-S2.54]
U21  BX-PZ2.54-2-3PZZ  [HDR-TH_6P-P2.54-V-M-R2-C3-S2.54]
U22  BX-PZ2.54-2-3PZZ  [HDR-TH_6P-P2.54-V-M-R2-C3-S2.54]
U23  BX-PZ2.54-2-3PZZ  [HDR-TH_6P-P2.54-V-M-R2-C3-S2.54]
U24  BX-PZ2.54-2-3PZZ  [HDR-TH_6P-P2.54-V-M-R2-C3-S2.54]
U25  BX-PZ2.54-2-3PZZ  [HDR-TH_6P-P2.54-V-M-R2-C3-S2.54]
U26  BX-PZ2.54-2-3PZZ  [HDR-TH_6P-P2.54-V-M-R2-C3-S2.54]
U27  BX-PZ2.54-2-3PZZ  [HDR-TH_6P-P2.54-V-M-R2-C3-S2.54]
U28  BX-PZ2.54-2-3PZZ  [HDR-TH_6P-P2.54-V-M-R2-C3-S2.54]
U29  BX-PZ2.54-2-3PZZ  [HDR-TH_6P-P2.54-V-M-R2-C3-S2.54]
U30  BX-PZ2.54-2-3PZZ  [HDR-TH_6P-P2.54-V-M-R2-C3-S2.54]
U31  BX-PZ2.54-2-3PZZ  [HDR-TH_6P-P2.54-V-M-R2-C3-S2.54]
U32  BX-PZ2.54-2-3PZZ  [HDR-TH_6P-P2.54-V-M-R2-C3-S2.54]
U33  BX-PZ2.54-2-3PZZ  [HDR-TH_6P-P2.54-V-M-R2-C3-S2.54]
U34  BX-PZ2.54-2-3PZZ  [HDR-TH_6P-P2.54-V-M-R2-C3-S2.54]
sheet SONAR
SONAR0  ZX-XH2.54-4PZZ  [CONN-TH_4P-P2.50_4PIN]
SONAR1  ZX-XH2.54-4PZZ  [CONN-TH_4P-P2.50_4PIN]
SONAR2  ZX-XH2.54-4PZZ  [CONN-TH_4P-P2.50_4PIN]
SONAR3  ZX-XH2.54-4PZZ  [CONN-TH_4P-P2.50_4PIN]
U35  TXB0106PWR  [TSSOP-16_L5.0-W4.4-P0.65-LS6.4-BL]
U36  TXB0106PWR  [TSSOP-16_L5.0-W4.4-P0.65-LS6.4-BL]
sheet Teensy
3.3V  PZ254V-11-04P  [HDR-TH_4P-P2.54-V-M]
3.3VEXT  WJ127-5.0-2P  [CONN-TH_2P-P5.00_CPC3703CTR]
5VEXT  WJ127-5.0-2P  [CONN-TH_2P-P5.00_CPC3703CTR]
C4  100nF  [C0805]
CR2032  CR2032-BS-6  [BAT-TH_CR2032-BS-6-1]
CUSTOM  WJ127-5.0-2P  [CONN-TH_2P-P5.00_CPC3703CTR]
ETHERNET  J1B1211CCD  [RJ45-TH_J1B1211CCD]
GND  PZ254V-11-04P  [HDR-TH_4P-P2.54-V-M]
H18  HX PZ2.54-2x2P ZZ  [HDR-TH_HX-PZ2.54-2X2P-ZZ]
H19  PZ254V-11-04P  [HDR-TH_4P-P2.54-V-M]
H20  PZ254V-11-04P  [HDR-TH_4P-P2.54-V-M]
HOSTUSB  BX-TYPE-A-MWT4P  [USB-A-SMD_BX-TYPE-A-MWT4P]
U12  -  [3.5mm_Hole]
U13  -  [3.5mm_Hole]
U14  -  [3.5mm_Hole]
U15  -  [3.5mm_Hole]
U37  Teensy 4.1  [MODULE_DEV-16771]

## Library data of the parts
CN56-CN63 CN72-CN87 = ZX-XH2.54-3PZZ: Pins Structure:1x3P Pitch:2.5mm Mounting Type:Direct Insert Reference Series:XH Number of Pins:3P Number of Rows:1 Number of PINs Per Row:3 Row Spacing:- Rated Current:3A Contact Material:Brass Contact Plating:Tin Operating Temperature:-25℃~+85℃ Operating; LCSC Part Name: 1x3P 间距:2.5mm 直插 系列:XH; Supplier Part: C7429633; Manufacturer: Megastar(兆星); Supplier Footprint: 插件,P=2.5mm; JLCPCB Part Class: Extended Part; Datasheet: https://atta.szlcsc.com/upload/public/pdf/source/20230619/AE17037A2CFDBE8D9CBA775D61AD0A84.pdf; Supplier: LCSC; Pins Structure: 1x3P; Pitch: 2.5mm; Mounting Type: Direct Insert; Reference Series: XH; Number of Pins: 3P; Number of Rows: 1; Number of PINs Per Row: 3; Rated Current: 3A; Contact Material: Brass; Contact Plating: Tin; Operating Temperature: -25℃~+85℃; Rated Voltage (Max): 250V; Plastic Material: PA66; Flame Retardant Rating: UL94V-0; Color: White; Z-Height of the Board: 7mm; X-Length of Bottom Edge on Board (Spacing Line): 10mm; Y-Width of Bottom Edge on Board: 5.9mm
U39 = CD74HC4051M96: LCSC Part Name: CD74HC4051 8通道模拟多路复用器; Supplier Part: C132065; Manufacturer: TI(德州仪器); Supplier Footprint: SOIC-16; JLCPCB Part Class: Extended Part; Datasheet: https://www.ti.com/cn/lit/gpn/cd74hc4051; Supplier: LCSC; Switch Circuit: SPST(SPST); Number of Channels: 8; Supply Voltage: 2V~6V; On-State Resistance (Max): 240Ω; Operating Temperature: -55℃~+125℃
CN10-CN12 CN14-CN21 CN64-CN71 SONAR0-SONAR3 = ZX-XH2.54-4PZZ: Pins Structure:1x4P Pitch:2.5mm Mounting Type:Direct Insert Reference Series:XH Number of Pins:4P Number of Rows:1 Number of PINs Per Row:4 Row Spacing:- Rated Current:3A Contact Material:Brass Contact Plating:Tin Operating Temperature:-25℃~+85℃ Operating; LCSC Part Name: 1x4P 间距:2.5mm 直插 系列:XH; Supplier Part: C7429634; Manufacturer: Megastar(兆星); Supplier Footprint: 插件,P=2.5mm; JLCPCB Part Class: Extended Part; Datasheet: https://atta.szlcsc.com/upload/public/pdf/source/20230619/B529A2163E0159A644AB3383D208FB03.pdf; Supplier: LCSC; Pins Structure: 1x4P; Pitch: 2.5mm; Mounting Type: Direct Insert; Reference Series: XH; Number of Pins: 4P; Number of Rows: 1; Number of PINs Per Row: 4; Rated Current: 3A; Contact Material: Brass; Contact Plating: Tin; Operating Temperature: -25℃~+85℃; Rated Voltage (Max): 250V; Plastic Material: PA66; Flame Retardant Rating: UL94V-0; Color: White; Z-Height of the Board: 7mm; X-Length of Bottom Edge on Board (Spacing Line): 12.5mm; Y-Width of Bottom Edge on Board: 5.9mm
I2C1-A0-I2C1-A2 I2C1-PWR I2C2-A0-I2C2-A2 I2C2-PWR I2CX-A0-I2CX-A2 PWM-A0-PWM-A5 = PZ254V-11-03P: Pin Structure:1x3P Pitch:2.54mm Row Spacing:- Circluar Pins/Square Pins:Policy Mounting Type:Straight Number of Rows:Single Row Number of Pins:3P Current Rating:3A Voltage Rating (Max):250V Length of Mating Pin:6mm Insulation Height:2.5mm Length of End Co; LCSC Part Name: 1x3P 间距:2.54mm 方针 直插; Supplier Part: C2937625; Manufacturer: XFCN(兴飞); Supplier Footprint: 插件,P=2.54mm; JLCPCB Part Class: Extended Part; Datasheet: https://atta.szlcsc.com/upload/public/pdf/source/20200309/C492402_8335C3D49C4E4C618838D59BB1D024C1.pdf; Supplier: LCSC; Pin Structure: 1x3P; Pitch: 2.54mm; Circluar Pins/Square Pins: Policy; Mounting Type: Straight; Number of Rows: Single Row; Number of Pins: 3P; Current Rating: 3A; Voltage Rating (Max): 250V; Length of Mating Pin: 6mm; Insulation Height: 2.5mm; Length of End Connection Pin: 3mm; Operating Temperature: -40℃~+105℃; Color: Black
R1-R18 R35-R53 = 0603WAF3001T5E: Type:Thick Film Resistors Resistance:3kΩ Tolerance:±1% Tolerance:±1% Power(Watts):0.1W Voltage-Supply(Max):75V Temperature Coefficient:±100ppm/℃ Temperature Coefficient:±100ppm/℃ Operating Temperature:-55℃~+155℃ Operating Temperature:-55℃~+155℃; LCSC Part Name: 3kΩ ±1% 100mW 厚膜电阻; Supplier Part: C4211; Manufacturer: UNI-ROYAL(厚声); Supplier Footprint: 0603; JLCPCB Part Class: Basic Part; Datasheet: https://atta.szlcsc.com/upload/public/pdf/source/20200306/C422600_1E6D84923E4A46A82E41ADD87F860B5C.pdf; Supplier: LCSC; Type: Thick Film Resistors; Tolerance: ±1%; Power(Watts): 0.1W; Voltage-Supply(Max): 75V; Temperature Coefficient: ±100ppm/℃; Operating Temperature: -55℃~+155℃
U2 U16 = TCA9548APWR: Supplier Part: C130026; Manufacturer: TI(德州仪器); Supplier Footprint: TSSOP-24; JLCPCB Part Class: Extended Part; Datasheet: https://www.ti.com/cn/lit/gpn/tca9548a; Supplier: LCSC
RN1-RN4 = 4D03WGJ0103T5E: LCSC Part Name: 10kΩ ±5%; Supplier Part: C29718; Manufacturer: UNI-ROYAL(厚声); Supplier Footprint: 0603x4; JLCPCB Part Class: Basic Part; Datasheet: https://atta.szlcsc.com/upload/public/pdf/source/20191224/C474318_2527498AE30E813171187CCD28401A71.pdf; Supplier: LCSC; Tolerance: ±5%; Temperature Coefficient: ±200ppm/℃
U17 = TCA9535PWR: Supplier Part: C130204; Manufacturer: TI(德州仪器); Supplier Footprint: TSSOP-24; JLCPCB Part Class: Extended Part; Datasheet: https://www.ti.com/cn/lit/gpn/tca9535; Supplier: LCSC; Interface: I2C；SMBus; Number of I/O: 16; Interrupt Output: With Interrupt Output; Voltage - Supply: 1.65V~5.5V; Clock Frequency: 400kHz; Operating Temperature: -40℃~+85℃
U4 U8 U40 U41 = ZX-XH2.54-6PZZ: Pins Structure:1x6P Pitch:2.5mm Mounting Type:Direct Insert Reference Series:XH Number of Pins:6P Number of Rows:1 Number of PINs Per Row:6 Row Spacing:- Rated Current:3A Contact Material:Brass Contact Plating:Tin Operating Temperature:-25℃~+85℃ Operating; LCSC Part Name: 1x6P 间距:2.5mm 直插 系列:XH; Supplier Part: C7429636; Manufacturer: Megastar(兆星); Supplier Footprint: 插件,P=2.5mm; JLCPCB Part Class: Extended Part; Datasheet: https://atta.szlcsc.com/upload/public/pdf/source/20230619/1243AD0A516E39CD3D274D8985780568.pdf; Supplier: LCSC; Pins Structure: 1x6P; Pitch: 2.5mm; Mounting Type: Direct Insert; Reference Series: XH; Number of Pins: 6P; Number of Rows: 1; Number of PINs Per Row: 6; Rated Current: 3A; Contact Material: Brass; Contact Plating: Tin; Operating Temperature: -25℃~+85℃; Rated Voltage (Max): 250V; Plastic Material: PA66; Flame Retardant Rating: UL94V-0; Color: White; Z-Height of the Board: 7mm; X-Length of Bottom Edge on Board (Spacing Line): 17.5mm; Y-Width of Bottom Edge on Board: 5.9mm
U5 U6 U42 = ZX-XH2.54-5PZZ: Pins Structure:1x5P Pitch:2.5mm Mounting Type:Direct Insert Reference Series:XH Number of Pins:5P Number of Rows:1 Number of PINs Per Row:5 Row Spacing:- Rated Current:3A Contact Material:Brass Contact Plating:Tin Operating Temperature:-25℃~+85℃ Operating; LCSC Part Name: 1x5P 间距:2.5mm 直插 系列:XH; Supplier Part: C7429635; Manufacturer: Megastar(兆星); Supplier Footprint: 插件,P=2.5mm; JLCPCB Part Class: Extended Part; Datasheet: https://atta.szlcsc.com/upload/public/pdf/source/20230619/60EEF4ADD558E90BFFACF5D939816781.pdf; Supplier: LCSC; Pins Structure: 1x5P; Pitch: 2.5mm; Mounting Type: Direct Insert; Reference Series: XH; Number of Pins: 5P; Number of Rows: 1; Number of PINs Per Row: 5; Rated Current: 3A; Contact Material: Brass; Contact Plating: Tin; Operating Temperature: -25℃~+85℃; Rated Voltage (Max): 250V; Plastic Material: PA66; Flame Retardant Rating: UL94V-0; Color: White; Z-Height of the Board: 7mm; X-Length of Bottom Edge on Board (Spacing Line): 15mm; Y-Width of Bottom Edge on Board: 5.9mm
C1-C3 = VT10UF16V167RV0128: LCSC Part Name: 10uF ±20% 16V; Supplier Part: C5246581; Manufacturer: KNSCHA(科尼盛); Supplier Footprint: SMD,D4xL5.4mm; JLCPCB Part Class: Extended Part; Datasheet: https://atta.szlcsc.com/upload/public/pdf/source/20221103/9F9BF07BB249386F3919A1DEC4ACBDCD.pdf; Supplier: LCSC; Tolerance: ±20%; Ripple Current: 18mA@120kHz; Lifetime @ Temp: 2000hrs@105℃; Operating Temperature: -55℃~+105℃
F1-F4 = YC164-JR-07220RL: LCSC Part Name: 220Ω ±5% 0603x4; Supplier Part: C706474; Manufacturer: YAGEO(国巨); Supplier Footprint: 0603x4; JLCPCB Part Class: Extended Part; Datasheet: https://atta.szlcsc.com/upload/public/pdf/source/20181031/C326869_C8B113A8CFF0517934C636AB0D29A6BD.pdf; Supplier: LCSC; Tolerance: ±5%; Temperature Coefficient: ±200ppm/℃
H2-H17 = PH-00013: LCSC Part Name: 1x2P 间距:2.54mm 方针 直插; Supplier Part: C2829889; Manufacturer: Liansheng(连盛); Supplier Footprint: 插件,P=2.54mm; JLCPCB Part Class: Extended Part; Datasheet: https://atta.szlcsc.com/upload/public/pdf/source/20210507/C2829889_3A6FAD2FEED7D368F2C068C6BF5A862B.pdf; Supplier: LCSC; Pin Structure: 1x2P; Pitch: 2.54mm; Circluar Pins/Square Pins: Policy; Mounting Type: Straight; Number of Rows: Single Row; Number of Pins: 2P; Current Rating: 3A; Length of Mating Pin: 6mm; Insulation Height: 2.5mm; Length of End Connection Pin: 3mm; Operating Temperature: -40℃~+105℃; Color: Black
LED1-LED16 = 19-219/GHC-YR2T1B5Y/3T: LCSC Part Name: 0603正贴式 绿灯(Iv=140~360mcd) @IF=20mA); Supplier Part: C2994781; Manufacturer: EVERLIGHT(亿光); Supplier Footprint: 0603; JLCPCB Part Class: Extended Part; Datasheet: https://atta.szlcsc.com/upload/public/pdf/source/20220419/8956FAA3247BD76AC23F3FF602030F9E.pdf; Supplier: LCSC; Emitted Color: Green; Dominant Wavelength: 518nm; Peak Wavelength: 525nm; Lens Color: Colorless transparent lens
U18 = PCA9685PW,118: Supplier Part: C2678753; Manufacturer: NXP(恩智浦); Supplier Footprint: TSSOP-28; JLCPCB Part Class: Extended Part; Datasheet: https://atta.szlcsc.com/upload/public/pdf/source/20170908/C92206_1504870161626958140.pdf; Supplier: LCSC; Input Voltage: 2.3V~5.5V; Switch Frequency: 100kHz~1MHz; Channels: 16; Output Voltage: 5.5V; Output Current: 25mA; Dimming: PWM; Operating temperature: -40℃~+85℃
U19-U34 = BX-PZ2.54-2-3PZZ: LCSC Part Name: 2x3P 间距:2.54mm 方针 直插; Supplier Part: C18078212; Manufacturer: Bossie(博锡); Supplier Footprint: 插件,P=2.54mm; JLCPCB Part Class: Extended Part; Datasheet: https://atta.szlcsc.com/upload/public/pdf/source/20231017/19B93BCADDDD73CB54F402EECF4A0840.pdf; Supplier: LCSC; Pin Structure: 2x3P; Pitch: 2.54mm; Row Spacing: 2.54mm; Circluar Pins/Square Pins: Policy; Mounting Type: Straight; Number of Rows: Double Row; Number of Pins: 3P; Current Rating: 3A; Voltage Rating (Max): 1kV; Length of Mating Pin: 6mm; Insulation Height: 2.5mm; Length of End Connection Pin: 3mm; Contact Material: Brass; Contact Plating: Gold; Operating Temperature: -40℃~+105℃; Color: Black
U35 U36 = TXB0106PWR: LCSC Part Name: 100Mbps 6位双向电平转换器; Supplier Part: C38253; Manufacturer: TI(德州仪器); Supplier Footprint: TSSOP-16; JLCPCB Part Class: Extended Part; Datasheet: https://www.ti.com/cn/lit/gpn/txb0106; Supplier: LCSC; Channel Type: Bidirectional; Data Rate: 100Mbps; Voltage - Supply(VCCA): 1.2V~3.6V; Voltage - Supply(VCCB): 1.65V~5.5V; Number of Circuits: 6; Output Type: Tri-State; Operating Temperature: -40℃~+85℃; Features: Automatic Direction Detection
3.3V GND H19 H20 = PZ254V-11-04P: LCSC Part Name: 间距:2.54mm 1x4P 直插 方针; Supplier Part: C2691448; Manufacturer: XFCN(兴飞); Supplier Footprint: 插件,P=2.54mm; JLCPCB Part Class: Extended Part; Datasheet: https://atta.szlcsc.com/upload/public/pdf/source/20200309/C492403_F9F19131791D08044AD4F84F8E751A34.pdf; Supplier: LCSC; Pin Structure: 1x4P; Pitch: 2.54mm; Circluar Pins/Square Pins: Square Pins; Mounting Type: Straight; Number of Rows: Plugin; Number of Pins: 4P; Current Rating (Max): 3A; Voltage Rating (Max): 250V; Length of Mating Pin: 6mm; Insulation Height: 2.5mm; Length of End Connection Pin: 3mm; Operating Temperature Range: -40℃~+105℃; Color: Black
3.3VEXT 5VEXT CUSTOM = WJ127-5.0-2P_C3703: Structure:1x2P Pitch:5mm Color:Green Mounting Style:Straight Current Rating (Max):15A Voltage Rating (Max):250V Number of Pins:2P Number of Rows:1 Wire Gauge - AWG:14~26 Wire Gauge - AWG:14~26 Wire Gauge - mm2:1.5 Wire Gauge - mm2:1.5 Number of PINs Per R; LCSC Part Name: 5mm 1x2P 排数:1 每排P数:2 直插; Supplier Part: C3703; Manufacturer: KANGNEX(康奈克斯电气); Supplier Footprint: 插件,P=5mm; JLCPCB Part Class: Extended Part; Datasheet: https://atta.szlcsc.com/upload/public/pdf/source/20191225/C3703_1F4D1F1BB9E32B564BC518663FFF2A0C.pdf; Supplier: LCSC; Structure: 1x2P; Pitch: 5mm; Color: Green; Mounting Style: Straight; Current Rating (Max): 15A; Voltage Rating (Max): 250V; Number of Pins: 2P; Number of Rows: 1; Wire Gauge - AWG: 14~26; Wire Gauge - mm2: 1.5; Number of PINs Per Row: 2; Operating Temperature Range: -40℃~+105℃
C4 = CT41G-0805-2X1-50V-0.1μF-K(N): LCSC Part Name: 100nF ±10% 50V; Supplier Part: C126469; Manufacturer: TORCH(火炬); Supplier Footprint: 0805; JLCPCB Part Class: Extended Part; Datasheet: https://atta.szlcsc.com/upload/public/pdf/source/20171225/C150708_15141883600121203188.pdf; Supplier: LCSC; Tolerance: ±10%; Voltage Rating: 50V
CR2032 = CR2032-BS-6: LCSC Part Name: 电池底座 CR2032-BS-6镀金贴板式电池座连接器; Supplier Part: C22363833; Manufacturer: LX(连欣科技); Supplier Footprint: SMD; JLCPCB Part Class: Extended Part; Datasheet: https://atta.szlcsc.com/upload/public/pdf/source/20240319/678C0773FABC2C605DCA22348524B46A.pdf; Supplier: LCSC
ETHERNET = J1B1211CCD: LCSC Part Name: 弯插 带LED; Supplier Part: C910371; Manufacturer: WIZNET; Supplier Footprint: 插件; JLCPCB Part Class: Extended Part; Datasheet: https://atta.szlcsc.com/upload/public/pdf/source/20201117/C910371_B77FEBE130C68A4769342AE009D6CC4A.pdf; Supplier: LCSC; Connector Type: RJ45Receptacle; Number of Ports: 1; Mounting Style: Right-Angle; Shielding: 有屏蔽; LED: WithLED; Ratings: cat5; Contact Material: 磷黄铜; Contact Plating: Gold; Operating Temperature Range: -40℃~+85℃
H18 = HX PZ2.54-2x2P ZZ: LCSC Part Name: 2x2P 间距:2.54mm 方针 直插; Supplier Part: C32713275; Manufacturer: hanxia(韩下); Supplier Footprint: 插件,P=2.54mm; JLCPCB Part Class: Extended Part; Datasheet: https://atta.szlcsc.com/upload/public/pdf/source/20240723/CE5FF0E3D3DC0CA9D26CA3411A561CD4.pdf; Supplier: LCSC; Pin Structure: 2x2P; Pitch: 2.54mm; Row Spacing: 2.54mm; Circluar Pins/Square Pins: Policy; Mounting Type: Straight; Number of Rows: Double Row; Number of Pins: 4P; Current Rating: 3A; Length of Mating Pin: 6mm; Insulation Height: 2.5mm; Length of End Connection Pin: 3mm; Contact Material: Brass; Contact Plating: Gold; Operating Temperature: -40℃~+105℃; Color: Black
HOSTUSB = BX-TYPE-A-MWT4P: LCSC Part Name: Type-A 母 卧贴; Supplier Part: C18077687; Manufacturer: Bossie(博锡); Supplier Footprint: SMD; JLCPCB Part Class: Extended Part; Datasheet: https://atta.szlcsc.com/upload/public/pdf/source/20231017/350728A20F220355EDDB8BD2D6C59ADE.pdf; Supplier: LCSC; Connector Type: Type-A; Protocol Standard: USB 2.0; Gender: Female; Mounting Type: Surface Mount, Right Angle; Number of Contacts: 4P; Number of Ports: 1; Current Rating-Power: 1.5A; Operating Temperature: -20℃~+70℃
U12-U15 = 3.5MMHole: Mounting hole
U37 = DEV-16771

## Nets
3.3V: 3.3V.1 3.3V.2 3.3V.3 3.3V.4 CN10.1 CN11.1 CN12.1 CN56.1 CN57.1 CN58.1 CN59.1 CN60.1 CN61.1 CN62.1 CN63.1 I2C1-A0.1 I2C1-A1.1 I2C1-A2.1 I2C1-PWR.1 I2C2-A0.1 I2C2-A1.1 I2C2-A2.1 I2C2-PWR.1 I2CX-A0.1 I2CX-A1.1 I2CX-A2.1 PWM-A0.1 PWM-A1.1 PWM-A2.1 PWM-A3.1 PWM-A4.1 PWM-A5.1 R1.1 R2.1 R3.1 R4.1 R5.1 R6.1 R7.1 R8.1 R9.2 R10.2 R11.2 R12.2 R13.2 R14.2 R15.2 R16.2 R17.2 R18.2 R35.1 R36.1 R37.1 R38.1 R39.1 R40.1 R41.1 R42.2 R43.2 R44.2 R45.2 R46.2 R47.2 R48.2 R49.2 R50.1 R51.2 R52.2 R53.2 RN1.1 RN1.2 RN1.3 RN1.4 RN2.1 RN2.2 RN2.3 RN2.4 RN3.1 RN3.2 RN3.3 RN3.4 RN4.1 RN4.2 RN4.3 RN4.4 U2.24(VCC) U5.1 U6.1 U16.24(VCC) U17.24(VCC) U18.28(VDD) U35.2(VCCA) U36.2(VCCA) U37.3.3V_1*3(3.3V) U39.16(VCC) U42.1
3.3VEXT: 3.3VEXT.2 C1.1 I2C1-PWR.3 I2C2-PWR.3 U19.1 U20.1 U21.1 U22.1 U23.1 U24.1 U25.1 U26.1 U27.1 U28.1 U29.1 U30.1 U31.1 U32.1 U33.1 U34.1
5VEXT: 5VEXT.2 C2.1 HOSTUSB.1(VCC) SONAR0.1 SONAR1.1 SONAR2.1 SONAR3.1 U4.1 U8.1 U19.3 U20.3 U21.3 U22.3 U23.3 U24.3 U25.3 U26.3 U27.3 U28.3 U29.3 U30.3 U31.3 U32.3 U33.3 U34.3 U35.8(OE) U35.15(VCCB) U36.8(OE) U36.15(VCCB) U37.VIN U40.1 U41.1
GND: 3.3VEXT.1 5VEXT.1 C1.2 C2.2 C3.2 C4.2 CN10.2 CN11.2 CN12.2 CN14.2 CN15.2 CN16.2 CN17.2 CN18.2 CN19.2 CN20.2 CN21.2 CN56.2 CN57.2 CN58.2 CN59.2 CN60.2 CN61.2 CN62.2 CN63.2 CN64.2 CN65.2 CN66.2 CN67.2 CN68.2 CN69.2 CN70.2 CN71.2 CN72.1 CN73.1 CN74.1 CN75.1 CN76.1 CN77.1 CN78.1 CN79.1 CN80.1 CN81.1 CN82.1 CN83.1 CN84.1 CN85.1 CN86.1 CN87.1 CR2032.2 CUSTOM.1 ETHERNET.8 ETHERNET.9(LLED-) GND.1 GND.2 GND.3 GND.4 H18.1 H18.3 HOSTUSB.4(GND) HOSTUSB.5 HOSTUSB.6 I2C1-A0.3 I2C1-A1.3 I2C1-A2.3 I2C2-A0.3 I2C2-A1.3 I2C2-A2.3 I2CX-A0.3 I2CX-A1.3 I2CX-A2.3 LED1.2(K) LED2.2(K) LED3.2(K) LED4.2(K) LED5.2(K) LED6.2(K) LED7.2(K) LED8.2(K) LED9.2(K) LED10.2(K) LED11.2(K) LED12.2(K) LED13.2(K) LED14.2(K) LED15.2(K) LED16.2(K) PWM-A0.3 PWM-A1.3 PWM-A2.3 PWM-A3.3 PWM-A4.3 PWM-A5.3 SONAR0.2 SONAR1.2 SONAR2.2 SONAR3.2 U2.12(GND) U4.2 U5.2 U6.2 U8.2 U16.12(GND) U17.12(GND) U18.14(VSS) U18.25(EXTCLK) U35.9(GND) U36.9(GND) U37.5V U37.GND1*5(GND) U37.USB_GND1*2(USB_GND) U39.7(VEE) U39.8(GND) U40.2 U41.2 U42.2
A0: U37.14(A0) U39.10(S1)
A1: U37.15(A1) U39.11(S0)
A17: U37.41(A17) U39.9(S2)
ANALOG: U37.40(A16) U39.3(A)
ANALOG-EN: RN2.5 U17.11(P07) U39.6(/E)
BCLK2: H19.3 U37.4(BCLK2)
CRX1: CN10.3 U37.23(A9)
CS: H20.2 U37.10(CS1)
CTX1: CN10.4 U37.22(A8)
CUST: C3.1 CUSTOM.2 U19.5 U20.5 U21.5 U22.5 U23.5 U24.5 U25.5 U26.5 U27.5 U28.5 U29.5 U30.5 U31.5 U32.5 U33.5 U34.5
ECHO0: U35.7(A6) U37.30(CRX3)
ECHO1: U35.5(A4) U37.32(OUT1B)
ECHO2: U36.7(A6) U37.34(RX8)
ECHO3: U36.5(A4) U37.36(CS2)
I2C1-RESET: RN1.8 U2.3(RESET#) U17.4(P00)
I2C2-RESET: RN1.7 U16.3(RESET#) U17.5(P01)
IN2: R51.1 U17.1(INT#) U37.5(IN2)
LRCLK2: U37.3(LRCLK2) U42.5
MISO: U4.4 U8.4 U37.12(MISO)
MISO1: U37.39(A15) U40.4 U41.4
MOSI: U4.3 U8.3 U37.11(MOSI)
MOSI1: U37.26(A12) U40.3 U41.3
OUT1A: H20.3 U37.38(A14)
OUT1C: U5.5 U37.9(OUT1C)
OUT1D: H20.1 U37.6(OUT1D)
OUT2: U6.5 U37.2(OUT2)
PWM-OE: RN1.6 U17.6(P02) U18.23(OE#)
RX1: U6.3 U37.0(RX1)
RX2: H19.1 U37.7(RX2)
RX5: U37.21(A7) U42.3
RX7: U5.3 U37.28(RX7)
SCK: U4.5 U8.5 U37.13(SCK)
SCK1: U37.27(A13) U40.5 U41.5
SCL: R17.1 U2.22(SCL) U17.22(SCL) U18.26(SCL) U37.19(A5)
SCL1: R52.1 U16.22(SCL) U37.16(A2)
SCL2: CN11.3 CN12.3 U37.24(A10)
SDA: R18.1 U2.23(SDA) U17.23(SDA) U18.27(SDA) U37.18(A4)
SDA1: R53.1 U16.23(SDA) U37.17(A3)
SDA2: CN11.4 CN12.4 U37.25(A11)
SPI0-SEL: RN1.5 U8.6 U17.7(P03)
SPI1-SEL: RN2.8 U4.6 U17.8(P04)
SPI2-SEL: RN2.7 U17.9(P05) U41.6
SPI3-SEL: RN2.6 U17.10(P06) U40.6
TRIG0: U35.6(A5) U37.31(CTX3)
TRIG1: U35.4(A3) U37.33(MCLK2)
TRIG2: U36.6(A5) U37.35(TX8)
TRIG3: U36.4(A3) U37.37(CS3)
TX1: U6.4 U37.1(TX1)
TX2: H19.2 U37.8(TX2)
TX5: U37.20(A6) U42.4
TX7: U5.4 U37.29(TX7)
$1N4291: ETHERNET.1 U37.T+
$1N4303: ETHERNET.3 U37.T-
$1N4309: C4.1 ETHERNET.2 ETHERNET.5
$1N4403: ETHERNET.4 U37.R+
$1N4422: ETHERNET.6 U37.R-
$1N4449: ETHERNET.10(LLED+) U37.LED
$1N4572: HOSTUSB.3(D+) U37.D+
$1N4583: HOSTUSB.2(D-) U37.D-
$1N4741: CR2032.1 U37.VBAT
$1N4831: H18.2 U37.PROGRAM
$1N4835: H18.4 U37.ON/OFF
$2N1400: CN14.4 R1.2 U2.4(SD0)
$2N1404: CN14.3 R2.2 U2.5(SC0)
$2N1409: CN15.4 R3.2 U2.6(SD1)
$2N1414: CN15.3 R4.2 U2.7(SC1)
$2N1419: CN16.4 R5.2 U2.8(SD2)
$2N1424: CN16.3 R6.2 U2.9(SC2)
$2N2020: CN18.3 R15.1 U2.14(SC4)
$2N2036: CN19.4 R14.1 U2.15(SD5)
$2N2050: CN19.3 R13.1 U2.16(SC5)
$2N2062: CN20.4 R12.1 U2.17(SD6)
$2N2072: CN20.3 R11.1 U2.18(SC6)
$2N2080: CN21.3 R9.1 U2.20(SC7)
$2N2083: CN21.4 R10.1 U2.19(SD7)
$2N2247: CN18.4 R16.1 U2.13(SD4)
$2N3196: CN17.4 R7.2 U2.10(SD3)
$2N3204: CN17.3 R8.2 U2.11(SC3)
$2N7247: I2C1-A2.2 U2.21(A2)
$2N7468: I2C1-A0.2 U2.1(A0)
$2N7474: I2C1-A1.2 U2.2(A1)
$2N8204: CN14.1 CN15.1 CN16.1 CN17.1 CN18.1 CN19.1 CN20.1 CN21.1 I2C1-PWR.2
$4N4120: SONAR0.4 U35.10(B6)
$4N4124: SONAR0.3 U35.11(B5)
$4N4129: SONAR1.4 U35.12(B4)
$4N4136: SONAR1.3 U35.13(B3)
$4N4631: SONAR3.3 U36.13(B3)
$4N4635: SONAR3.4 U36.12(B4)
$4N4656: SONAR2.3 U36.11(B5)
$4N4658: SONAR2.4 U36.10(B6)
$6N1538: CN64.1 CN65.1 CN66.1 CN67.1 CN68.1 CN69.1 CN70.1 CN71.1 I2C2-PWR.2
$6N1585: CN70.3 R44.1 U16.18(SC6)
$6N1586: CN70.4 R45.1 U16.17(SD6)
$6N1587: CN71.3 R42.1 U16.20(SC7)
$6N1588: CN71.4 R43.1 U16.19(SD7)
$6N1589: CN68.3 R48.1 U16.14(SC4)
$6N1590: CN68.4 R49.1 U16.13(SD4)
$6N1591: CN69.3 R46.1 U16.16(SC5)
$6N1592: CN69.4 R47.1 U16.15(SD5)
$6N1593: CN67.4 R41.2 U16.10(SD3)
$6N1594: CN67.3 R50.2 U16.11(SC3)
$6N1595: CN66.4 R39.2 U16.8(SD2)
$6N1596: CN66.3 R40.2 U16.9(SC2)
$6N1597: I2C2-A1.2 U16.2(A1)
$6N1603: CN64.3 R36.2 U16.5(SC0)
$6N1604: CN65.3 R38.2 U16.7(SC1)
$6N1605: CN65.4 R37.2 U16.6(SD1)
$6N1606: CN64.4 R35.2 U16.4(SD0)
$6N1613: I2C2-A2.2 U16.21(A2)
$6N1619: I2C2-A0.2 U16.1(A0)
$7N431: I2CX-A2.2 U17.3(A2)
$7N461: I2CX-A0.2 U17.21(A0)
$7N494: I2CX-A1.2 U17.2(A1)
$7N1640: RN3.8 U17.13(P10)
$7N2553: RN3.7 U17.14(P11)
$7N2557: RN3.6 U17.15(P12)
$7N2565: RN3.5 U17.16(P13)
$7N2571: RN4.8 U17.17(P14)
$7N2577: RN4.7 U17.18(P15)
$7N2583: RN4.6 U17.19(P16)
$7N2589: RN4.5 U17.20(P17)
$8N609: PWM-A5.2 U18.24(A5)
$8N614: PWM-A4.2 U18.5(A4)
$8N620: PWM-A3.2 U18.4(A3)
$8N629: PWM-A2.2 U18.3(A2)
$8N635: PWM-A1.2 U18.2(A1)
$8N641: PWM-A0.2 U18.1(A0)
$8N1428: F2.7 U18.11(LED5)
$8N1434: F2.8 U18.10(LED4)
$8N1464: F3.8 U18.15(LED8)
$8N1475: F3.7 U18.16(LED9)
$8N1480: F3.6 U18.17(LED10)
$8N1486: F3.5 U18.18(LED11)
$8N1492: F4.8 U18.19(LED12)
$8N1498: F4.7 U18.20(LED13)
$8N1504: F4.6 U18.21(LED14)
$8N1510: F4.5 U18.22(LED15)
$8N2978: CN72.3 F1.1 H3.1
$8N2992: CN75.3 F1.4 H5.1
$8N2997: CN76.3 F2.1 H6.1
$8N3002: CN77.3 F2.2 H7.1
$8N3012: CN79.3 F2.4 H9.1
$8N3017: CN80.3 F3.1 H10.1
$8N3022: CN81.3 F3.2 H11.1
$8N3027: CN82.3 F3.3 H12.1
$8N3032: CN83.3 F3.4 H13.1
$8N3037: CN84.3 F4.1 H14.1
$8N3042: CN85.3 F4.2 H15.1
$8N3052: CN87.3 F4.4 H17.1
$8N4670: CN72.2 U19.2 U19.4 U19.6
$8N4694: CN73.2 U20.2 U20.4 U20.6
$8N4724: CN74.2 U21.2 U21.4 U21.6
$8N4754: CN75.2 U22.2 U22.4 U22.6
$8N4784: CN76.2 U23.2 U23.4 U23.6
$8N4828: CN77.2 U24.2 U24.4 U24.6
$8N4858: CN78.2 U25.2 U25.4 U25.6
$8N4888: CN79.2 U26.2 U26.4 U26.6
$8N4918: CN80.2 U27.2 U27.4 U27.6
$8N4948: CN81.2 U28.2 U28.4 U28.6
$8N4978: CN82.2 U29.2 U29.4 U29.6
$8N5008: CN83.2 U30.2 U30.4 U30.6
$8N5038: CN84.2 U31.2 U31.4 U31.6
$8N5068: CN85.2 U32.2 U32.4 U32.6
$8N5098: CN86.2 U33.2 U33.4 U33.6
$8N5128: CN87.2 U34.2 U34.4 U34.6
$8N6736: H2.2 LED1.1(A)
$8N6957: H3.2 LED2.1(A)
$8N7045: H4.2 LED3.1(A)
$8N7133: H5.2 LED4.1(A)
$8N7221: H6.2 LED5.1(A)
$8N7309: H7.2 LED6.1(A)
$8N7397: H8.2 LED7.1(A)
$8N7627: H10.2 LED9.1(A)
$8N7715: H11.2 LED10.1(A)
$8N7803: H12.2 LED11.1(A)
$8N7891: H13.2 LED12.1(A)
$8N7979: H14.2 LED13.1(A)
$8N8067: H15.2 LED14.1(A)
$8N8155: H16.2 LED15.1(A)
$8N8243: H17.2 LED16.1(A)
$8N9055: H9.2 LED8.1(A)
$8N10275: CN74.3 F1.3 H4.1
$8N10279: CN73.3 F1.2 H2.1
$8N10482: F2.5 U18.13(LED7)
$8N10501: F2.6 U18.12(LED6)
$8N10574: CN78.3 F2.3 H8.1
$8N10899: CN86.3 F4.3 H16.1
$8N10964: F1.6 U18.8(LED2)
$8N10973: F1.7 U18.7(LED1)
$8N10976: F1.8 U18.6(LED0)
$8N11089: F1.5 U18.9(LED3)
$9N727: CN58.3 U39.5(A5)
$9N728: CN59.3 U39.1(A4)
$9N729: CN60.3 U39.12(A3)
$9N730: CN57.3 U39.2(A6)
$9N731: CN56.3 U39.4(A7)
$9N732: CN61.3 U39.15(A2)
$9N733: CN63.3 U39.13(A0)
$9N734: CN62.3 U39.14(A1)

Not connected (* = marked no-connect by the designer): ETHERNET 7* 11(RLED-)* 12(RLED+)* 13(GND)* 14(GND)*; H19 4*; H20 4*; U35 1(A1)* 3(A2)* 14(B2)* 16(B1)*; U36 1(A1)* 3(A2)* 14(B2)* 16(B1)*; U37 VUSB*

## Notes on the sheets
sheet 3
- SPI-2 Bus
- SPI-1 Bus
- CANBUS
- I2C-3
- UART-1
- UART-3
- UART-2
sheet 8
- Analog Inputs
